# EAGLE design spu-schematic (EAGLE 9.6.2)
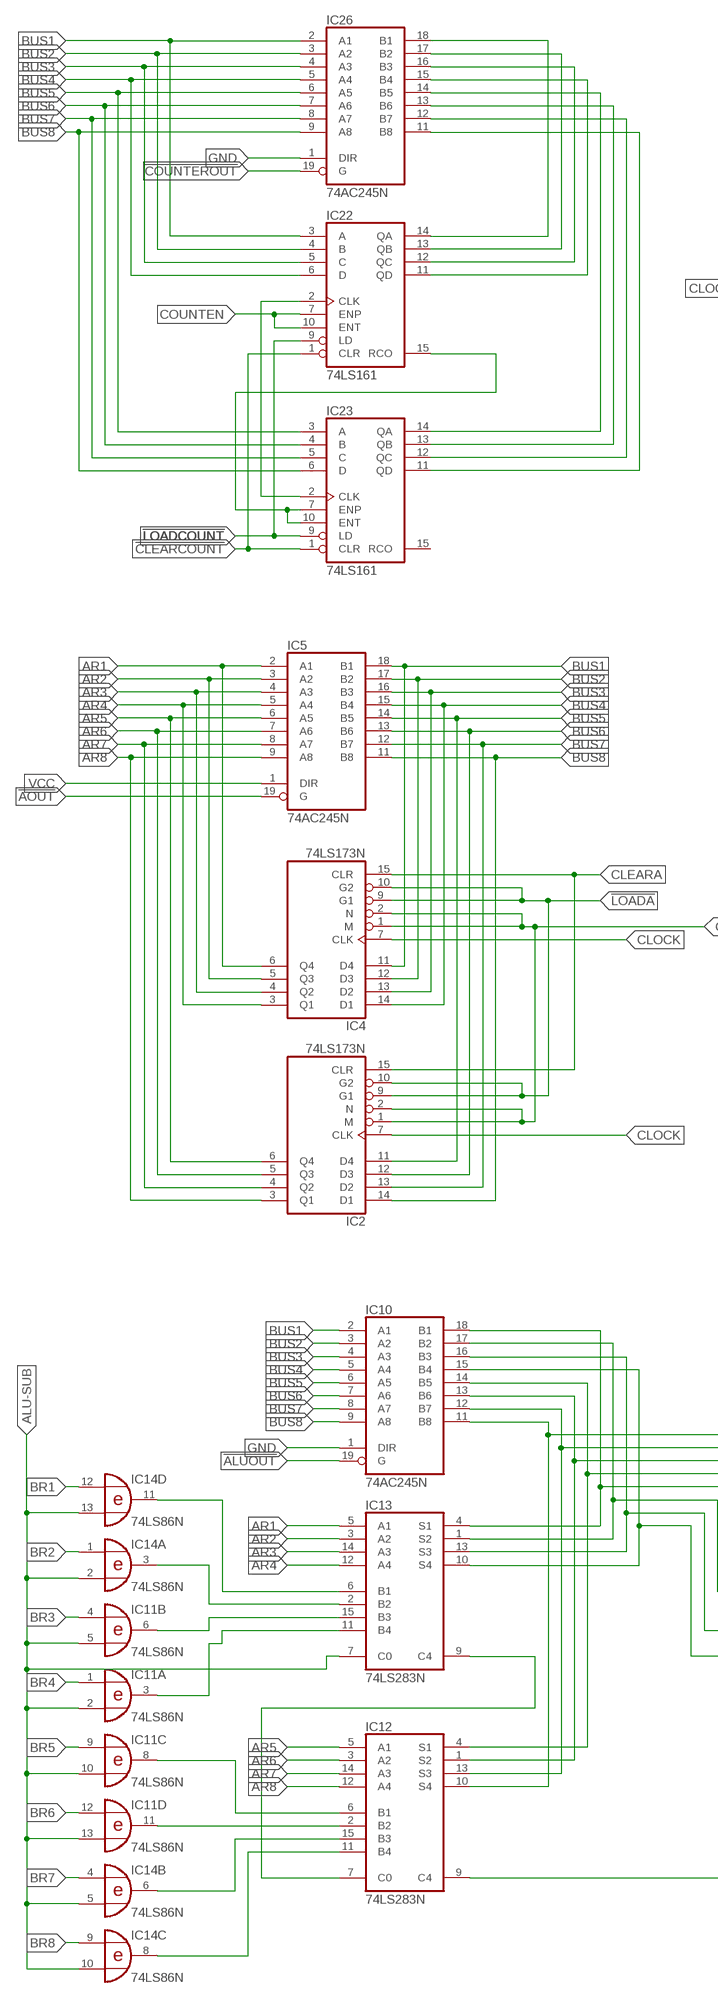
[diagram p0: schematic, sheet 1, part 1 of 2]
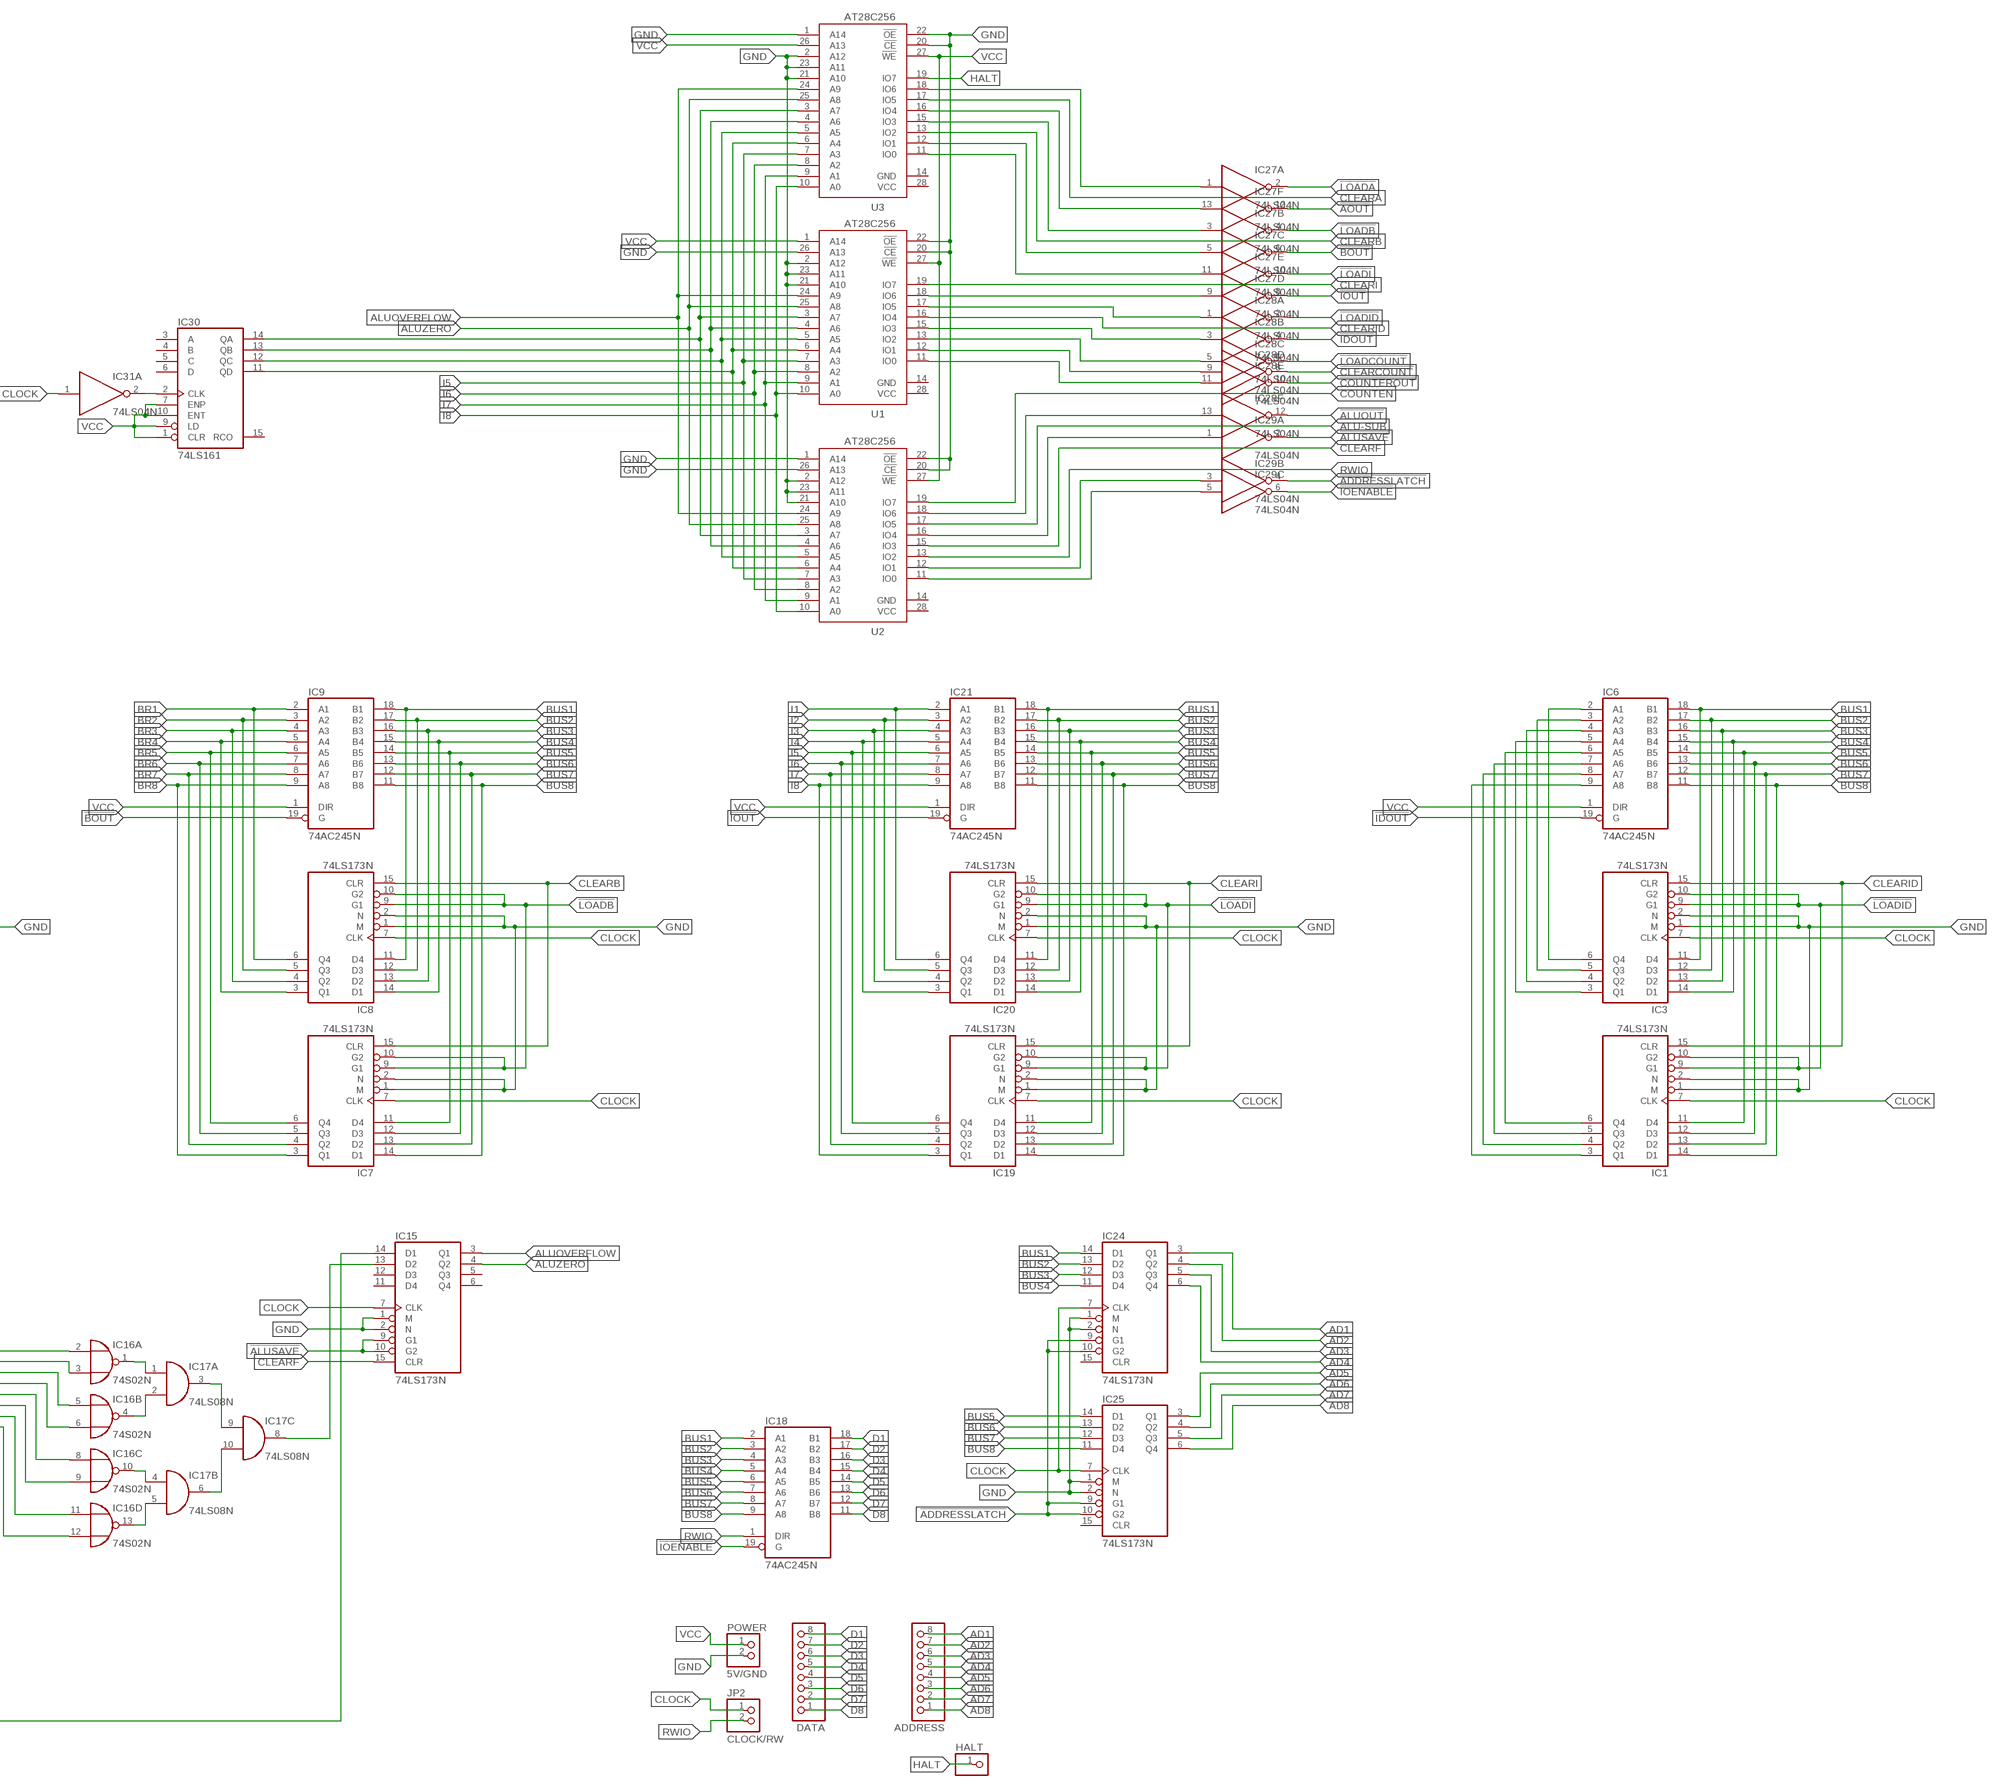
[diagram p1: schematic, sheet 1, part 2 of 2]

## Parts
ADDRESS  PINHD-1X8  [1X08]
DATA  PINHD-1X8  [1X08]
HALT  PINHD-1X1  [1X01]
IC1  74LS173N  [DIL16]
IC2  74LS173N  [DIL16]
IC3  74LS173N  [DIL16]
IC4  74LS173N  [DIL16]
IC5  74AC245N  [DIL20]
IC6  74AC245N  [DIL20]
IC7  74LS173N  [DIL16]
IC8  74LS173N  [DIL16]
IC9  74AC245N  [DIL20]
IC10  74AC245N  [DIL20]
IC11  74LS86N  [DIL14]
IC12  74LS283N  [DIL16]
IC13  74LS283N  [DIL16]
IC14  74LS86N  [DIL14]
IC15  74LS173N  [DIL16]
IC16  74S02N  [DIL14]
IC17  74LS08N  [DIL14]
IC18  74AC245N  [DIL20]
IC19  74LS173N  [DIL16]
IC20  74LS173N  [DIL16]
IC21  74AC245N  [DIL20]
IC22  74LS161  74HCT160N  [DIL16]
IC23  74LS161  74HCT160N  [DIL16]
IC24  74LS173N  [DIL16]
IC25  74LS173N  [DIL16]
IC26  74AC245N  [DIL20]
IC27  74LS04N  [DIL14]
IC28  74LS04N  [DIL14]
IC29  74LS04N  [DIL14]
IC30  74LS161  74HC160N  [DIL16]
IC31  74LS04N  [DIL14]
JP2  CLOCK/RW  PINHD-1X2  [1X02]
POWER  5V/GND  PINHD-1X2  [1X02]
U1  AT28C256  [DIL28-6]
U2  AT28C256  [DIL28-6]
U3  AT28C256  [DIL28-6]

## Nets
!ADDRESSLATCH: IC24.9(G1) IC24.10(G2) IC25.9(G1) IC25.10(G2) IC29.4(B:O)
!ALUOUT: IC10.19(G) IC28.12(F:O)
!ALUSAVE: IC15.9(G1) IC15.10(G2) IC29.2(A:O)
!AOUT: IC5.19(G) IC27.12(F:O)
!BOUT: IC9.19(G) IC27.6(C:O)
!CLEARCOUNT: IC22.1(CLR) IC23.1(CLR) IC28.8(D:O)
!COUNTEROUT: IC26.19(G) IC28.10(E:O)
!IDOUT: IC6.19(G) IC28.4(B:O)
!IOENABLE: IC18.19(G) IC29.6(C:O)
!IOUT: IC21.19(G) IC27.8(D:O)
!LOADA: IC2.9(G1) IC2.10(G2) IC4.9(G1) IC4.10(G2) IC27.2(A:O)
!LOADB: IC7.9(G1) IC7.10(G2) IC8.9(G1) IC8.10(G2) IC27.4(B:O)
!LOADCOUNT: IC22.9(LD) IC23.9(LD) IC28.6(C:O)
!LOADI: IC19.9(G1) IC19.10(G2) IC20.9(G1) IC20.10(G2) IC27.10(E:O)
!LOADID: IC1.9(G1) IC1.10(G2) IC3.9(G1) IC3.10(G2) IC28.2(A:O)
AD1: ADDRESS.8 IC24.3(Q1)
AD2: ADDRESS.7 IC24.4(Q2)
AD3: ADDRESS.6 IC24.5(Q3)
AD4: ADDRESS.5 IC24.6(Q4)
AD5: ADDRESS.4 IC25.3(Q1)
AD6: ADDRESS.3 IC25.4(Q2)
AD7: ADDRESS.2 IC25.5(Q3)
AD8: ADDRESS.1 IC25.6(Q4)
ALU-SUB: IC11.2(A:I1) IC11.5(B:I1) IC11.10(C:I1) IC11.13(D:I1) IC13.7(C0) IC14.2(A:I1) IC14.5(B:I1) IC14.10(C:I1) IC14.13(D:I1) U2.17(IO5)
ALUOVERFLOW: IC15.3(Q1) U1.24(A9) U2.24(A9) U3.24(A9)
ALUZERO: IC15.4(Q2) U1.25(A8) U2.25(A8) U3.25(A8)
AR1: IC4.6(Q4) IC5.2(A1) IC13.5(A1)
AR2: IC4.5(Q3) IC5.3(A2) IC13.3(A2)
AR3: IC4.4(Q2) IC5.4(A3) IC13.14(A3)
AR4: IC4.3(Q1) IC5.5(A4) IC13.12(A4)
AR5: IC2.6(Q4) IC5.6(A5) IC12.5(A1)
AR6: IC2.5(Q3) IC5.7(A6) IC12.3(A2)
AR7: IC2.4(Q2) IC5.8(A7) IC12.14(A3)
AR8: IC2.3(Q1) IC5.9(A8) IC12.12(A4)
BR1: IC8.6(Q4) IC9.2(A1) IC14.12(D:I0)
BR2: IC8.5(Q3) IC9.3(A2) IC14.1(A:I0)
BR3: IC8.4(Q2) IC9.4(A3) IC11.4(B:I0)
BR4: IC8.3(Q1) IC9.5(A4) IC11.1(A:I0)
BR5: IC7.6(Q4) IC9.6(A5) IC11.9(C:I0)
BR6: IC7.5(Q3) IC9.7(A6) IC11.12(D:I0)
BR7: IC7.4(Q2) IC9.8(A7) IC14.4(B:I0)
BR8: IC7.3(Q1) IC9.9(A8) IC14.9(C:I0)
BR9: IC3.6(Q4) IC6.2(A1)
BR10: IC3.5(Q3) IC6.3(A2)
BR11: IC3.4(Q2) IC6.4(A3)
BR12: IC3.3(Q1) IC6.5(A4)
BR13: IC1.5(Q3) IC6.7(A6)
BR14: IC1.6(Q4) IC6.6(A5)
BR15: IC1.4(Q2) IC6.8(A7)
BR16: IC1.3(Q1) IC6.9(A8)
BUS1: IC3.11(D4) IC4.11(D4) IC5.18(B1) IC6.18(B1) IC8.11(D4) IC9.18(B1) IC10.2(A1) IC18.2(A1) IC20.11(D4) IC21.18(B1) IC22.3(A) IC24.14(D1) IC26.2(A1)
BUS2: IC3.12(D3) IC4.12(D3) IC5.17(B2) IC6.17(B2) IC8.12(D3) IC9.17(B2) IC10.3(A2) IC18.3(A2) IC20.12(D3) IC21.17(B2) IC22.4(B) IC24.13(D2) IC26.3(A2)
BUS3: IC3.13(D2) IC4.13(D2) IC5.16(B3) IC6.16(B3) IC8.13(D2) IC9.16(B3) IC10.4(A3) IC18.4(A3) IC20.13(D2) IC21.16(B3) IC22.5(C) IC24.12(D3) IC26.4(A3)
BUS4: IC3.14(D1) IC4.14(D1) IC5.15(B4) IC6.15(B4) IC8.14(D1) IC9.15(B4) IC10.5(A4) IC18.5(A4) IC20.14(D1) IC21.15(B4) IC22.6(D) IC24.11(D4) IC26.5(A4)
BUS5: IC1.11(D4) IC2.11(D4) IC5.14(B5) IC6.14(B5) IC7.11(D4) IC9.14(B5) IC10.6(A5) IC18.6(A5) IC19.11(D4) IC21.14(B5) IC23.3(A) IC25.14(D1) IC26.6(A5)
BUS6: IC1.12(D3) IC2.12(D3) IC5.13(B6) IC6.13(B6) IC7.12(D3) IC9.13(B6) IC10.7(A6) IC18.7(A6) IC19.12(D3) IC21.13(B6) IC23.4(B) IC25.13(D2) IC26.7(A6)
BUS7: IC1.13(D2) IC2.13(D2) IC5.12(B7) IC6.12(B7) IC7.13(D2) IC9.12(B7) IC10.8(A7) IC18.8(A7) IC19.13(D2) IC21.12(B7) IC23.5(C) IC25.12(D3) IC26.8(A7)
BUS8: IC1.14(D1) IC2.14(D1) IC5.11(B8) IC6.11(B8) IC7.14(D1) IC9.11(B8) IC10.9(A8) IC18.9(A8) IC19.14(D1) IC21.11(B8) IC23.6(D) IC25.11(D4) IC26.9(A8)
CLEARA: IC2.15(CLR) IC4.15(CLR) U3.17(IO5)
CLEARB: IC7.15(CLR) IC8.15(CLR) U3.13(IO2)
CLEARF: IC15.15(CLR) U2.15(IO3)
CLEARI: IC19.15(CLR) IC20.15(CLR) U1.19(IO7)
CLEARID: IC1.15(CLR) IC3.15(CLR) U1.16(IO4)
CLOCK: IC1.7(CLK) IC2.7(CLK) IC3.7(CLK) IC4.7(CLK) IC7.7(CLK) IC8.7(CLK) IC15.7(CLK) IC19.7(CLK) IC20.7(CLK) IC24.7(CLK) IC25.7(CLK) IC30.2(CLK) IC31.1(A:I) IC31.2(A:O) JP2.1
COUNTEN: IC22.7(ENP) IC22.10(ENT) U2.19(IO7)
D1: DATA.8 IC18.18(B1)
D2: DATA.7 IC18.17(B2)
D3: DATA.6 IC18.16(B3)
D4: DATA.5 IC18.15(B4)
D5: DATA.4 IC18.14(B5)
D6: DATA.3 IC18.13(B6)
D7: DATA.2 IC18.12(B7)
D8: DATA.1 IC18.11(B8)
GND [power]: IC1.1(M) IC1.2(N) IC2.1(M) IC2.2(N) IC3.1(M) IC3.2(N) IC4.1(M) IC4.2(N) IC7.1(M) IC7.2(N) IC8.1(M) IC8.2(N) IC10.1(DIR) IC15.1(M) IC15.2(N) IC19.1(M) IC19.2(N) IC20.1(M) IC20.2(N) IC24.1(M) IC24.2(N) IC25.1(M) IC25.2(N) IC26.1(DIR) POWER.2 U1.2(A12) U1.20(!CE) U1.21(A10) U1.22(!OE) U1.23(A11) U1.26(A13) U2.1(A14) U2.2(A12) U2.20(!CE) U2.21(A10) U2.22(!OE) U2.23(A11) U2.26(A13) U3.1(A14) U3.2(A12) U3.20(!CE) U3.21(A10) U3.22(!OE) U3.23(A11)
HALT: HALT.1 U3.19(IO7)
I1: IC20.6(Q4) IC21.2(A1)
I2: IC20.5(Q3) IC21.3(A2)
I3: IC20.4(Q2) IC21.4(A3)
I4: IC20.3(Q1) IC21.5(A4)
I5: IC19.6(Q4) IC21.6(A5) U1.7(A3) U2.7(A3) U3.7(A3)
I6: IC19.5(Q3) IC21.7(A6) U1.8(A2) U2.8(A2) U3.8(A2)
I7: IC19.4(Q2) IC21.8(A7) U1.9(A1) U2.9(A1) U3.9(A1)
I8: IC19.3(Q1) IC21.9(A8) U1.10(A0) U2.10(A0) U3.10(A0)
N$1: IC12.7(C0) IC13.9(C4)
N$2: IC12.11(B4) IC14.8(C:O)
N$3: IC12.9(C4) IC15.14(D1)
N$4: IC10.14(B5) IC12.4(S1) IC16.6(B:I1)
N$5: IC10.13(B6) IC12.1(S2) IC16.5(B:I0)
N$6: IC13.6(B1) IC14.11(D:O)
N$7: IC13.2(B2) IC14.3(A:O)
N$8: IC11.6(B:O) IC13.15(B3)
N$9: IC11.3(A:O) IC13.11(B4)
N$10: IC10.18(B1) IC13.4(S1) IC16.8(C:I0)
N$11: IC10.17(B2) IC13.1(S2) IC16.9(C:I1)
N$12: IC10.16(B3) IC13.13(S3) IC16.11(D:I0)
N$13: IC10.15(B4) IC13.10(S4) IC16.12(D:I1)
N$14: IC10.12(B7) IC12.13(S3) IC16.3(A:I1)
N$15: IC10.11(B8) IC12.10(S4) IC16.2(A:I0)
N$16: IC16.1(A:O) IC17.1(A:I0)
N$17: IC22.15(RCO) IC23.7(ENP) IC23.10(ENT)
N$18: IC29.3(B:I) U2.12(IO1)
N$19: IC22.2(CLK) IC23.2(CLK)
N$20: IC29.5(C:I) U2.11(IO0)
N$21: IC11.8(C:O) IC12.6(B1)
N$22: IC11.11(D:O) IC12.2(B2)
N$23: IC12.15(B3) IC14.6(B:O)
N$24: IC22.14(QA) IC26.18(B1)
N$25: IC22.13(QB) IC26.17(B2)
N$26: IC16.4(B:O) IC17.2(A:I1)
N$27: IC16.10(C:O) IC17.4(B:I0)
N$28: IC16.13(D:O) IC17.5(B:I1)
N$29: IC17.3(A:O) IC17.9(C:I0)
N$30: IC17.6(B:O) IC17.10(C:I1)
N$31: IC15.13(D2) IC17.8(C:O)
N$32: IC22.12(QC) IC26.16(B3)
N$33: IC22.11(QD) IC26.15(B4)
N$34: IC23.14(QA) IC26.14(B5)
N$35: IC23.13(QB) IC26.13(B6)
N$36: IC23.12(QC) IC26.12(B7)
N$37: IC23.11(QD) IC26.11(B8)
N$38: IC29.1(A:I) U2.16(IO4)
N$39: IC28.13(F:I) U2.18(IO6)
N$40: IC28.11(E:I) U1.11(IO0)
N$41: IC28.9(D:I) U1.12(IO1)
N$42: IC28.5(C:I) U1.13(IO2)
N$43: IC28.3(B:I) U1.15(IO3)
N$44: IC28.1(A:I) U1.17(IO5)
N$45: IC27.9(D:I) U1.18(IO6)
N$46: IC27.11(E:I) U3.11(IO0)
N$47: IC27.5(C:I) U3.12(IO1)
N$48: IC27.3(B:I) U3.15(IO3)
N$49: IC27.13(F:I) U3.16(IO4)
N$50: IC27.1(A:I) U3.18(IO6)
N$51: IC30.14(QA) U1.3(A7) U2.3(A7) U3.3(A7)
N$55: IC30.13(QB) U1.4(A6) U2.4(A6) U3.4(A6)
N$56: IC30.12(QC) U1.5(A5) U2.5(A5) U3.5(A5)
N$57: IC30.11(QD) U1.6(A4) U2.6(A4) U3.6(A4)
RWIO: IC18.1(DIR) JP2.2 U2.13(IO2)
VCC [power]: IC5.1(DIR) IC6.1(DIR) IC9.1(DIR) IC21.1(DIR) IC30.1(CLR) IC30.7(ENP) IC30.9(LD) IC30.10(ENT) POWER.1 U1.1(A14) U1.27(!WE) U2.27(!WE) U3.26(A13) U3.27(!WE)
Unconnected: IC15.5(Q3) IC15.6(Q4) IC15.11(D4) IC15.12(D3) IC17.11(D:O) IC17.12(D:I0) IC17.13(D:I1) IC23.15(RCO) IC24.15(CLR) IC25.15(CLR) IC29.8(D:O) IC29.9(D:I) IC29.10(E:O) IC29.11(E:I) IC29.12(F:O) IC29.13(F:I) IC30.3(A) IC30.4(B) IC30.5(C) IC30.6(D) IC30.15(RCO) IC31.3(B:I) IC31.4(B:O) IC31.5(C:I) IC31.6(C:O) IC31.8(D:O) IC31.9(D:I) IC31.10(E:O) IC31.11(E:I) IC31.12(F:O) IC31.13(F:I) U1.14(GND) U1.28(VCC) U2.14(GND) U2.28(VCC) U3.14(GND) U3.28(VCC)

## Power pins joined to a net without a drawn wire
GND: IC1.8(GND) IC2.8(GND) IC3.8(GND) IC4.8(GND) IC5.10(GND) IC6.10(GND) IC7.8(GND) IC8.8(GND) IC9.10(GND) IC10.10(GND) IC11.7(P:GND) IC12.8(GND) IC13.8(GND) IC14.7(P:GND) IC15.8(GND) IC16.7(P:GND) IC17.7(P:GND) IC18.10(GND) IC19.8(GND) IC20.8(GND) IC21.10(GND) IC22.8(GND) IC23.8(GND) IC24.8(GND) IC25.8(GND) IC26.10(GND) IC27.7(P:GND) IC28.7(P:GND) IC29.7(P:GND) IC30.8(GND) IC31.7(P:GND)
VCC: IC1.16(VCC) IC2.16(VCC) IC3.16(VCC) IC4.16(VCC) IC5.20(VCC) IC6.20(VCC) IC7.16(VCC) IC8.16(VCC) IC9.20(VCC) IC10.20(VCC) IC11.14(P:VCC) IC12.16(VCC) IC13.16(VCC) IC14.14(P:VCC) IC15.16(VCC) IC16.14(P:VCC) IC17.14(P:VCC) IC18.20(VCC) IC19.16(VCC) IC20.16(VCC) IC21.20(VCC) IC22.16(VCC) IC23.16(VCC) IC24.16(VCC) IC25.16(VCC) IC26.20(VCC) IC27.14(P:VCC) IC28.14(P:VCC) IC29.14(P:VCC) IC30.16(VCC) IC31.14(P:VCC)

## Library data of the parts
ADDRESS DATA = pinhead:PINHD-1X8: PIN HEADER
HALT = pinhead:PINHD-1X1: PIN HEADER
IC1-IC4 IC7 IC8 IC15 IC19 IC20 IC24 IC25 = 74xx-us:74*173: 4-bit D type REGISTER, 3-state
IC5 IC6 IC9 IC10 IC18 IC21 IC26 = 74xx-eu:74*245: Octal BUS TRANSCEIVER, 3-state
IC11 IC14 = 74xx-eu:74*86: Quad 2-input EXCLUSIVE-OR (XOR) gate
IC12 IC13 = 74xx-eu:74*283: 4-bit binary FULL ADDER, fast carry
IC16 = 74xx-eu:74*02: Quad 2-input NOR gate
IC17 = 74xx-eu:74*08: Quad 2-input AND gate
IC22 IC23 IC30 = 74xx-eu:74*160: Synchronous 4-bit COUNTER
IC27-IC29 IC31 = 74xx-eu:74*04: Hex INVERTER
JP2 POWER = pinhead:PINHD-1X2: PIN HEADER
U1-U3 = bt_memory:AT28C256: EEPROM 32Kx8 256k bit The AT28C256 is a high-performance Electrically Erasable and Programmable Read Only Memory. Its 256K of memory is organized as 32,768 words by 8 bits.

## Net classes
0 default: width 0.762 mm, clearance 0.2 mm
1 power: width 0.762 mm, clearance 0.2 mm

## Board
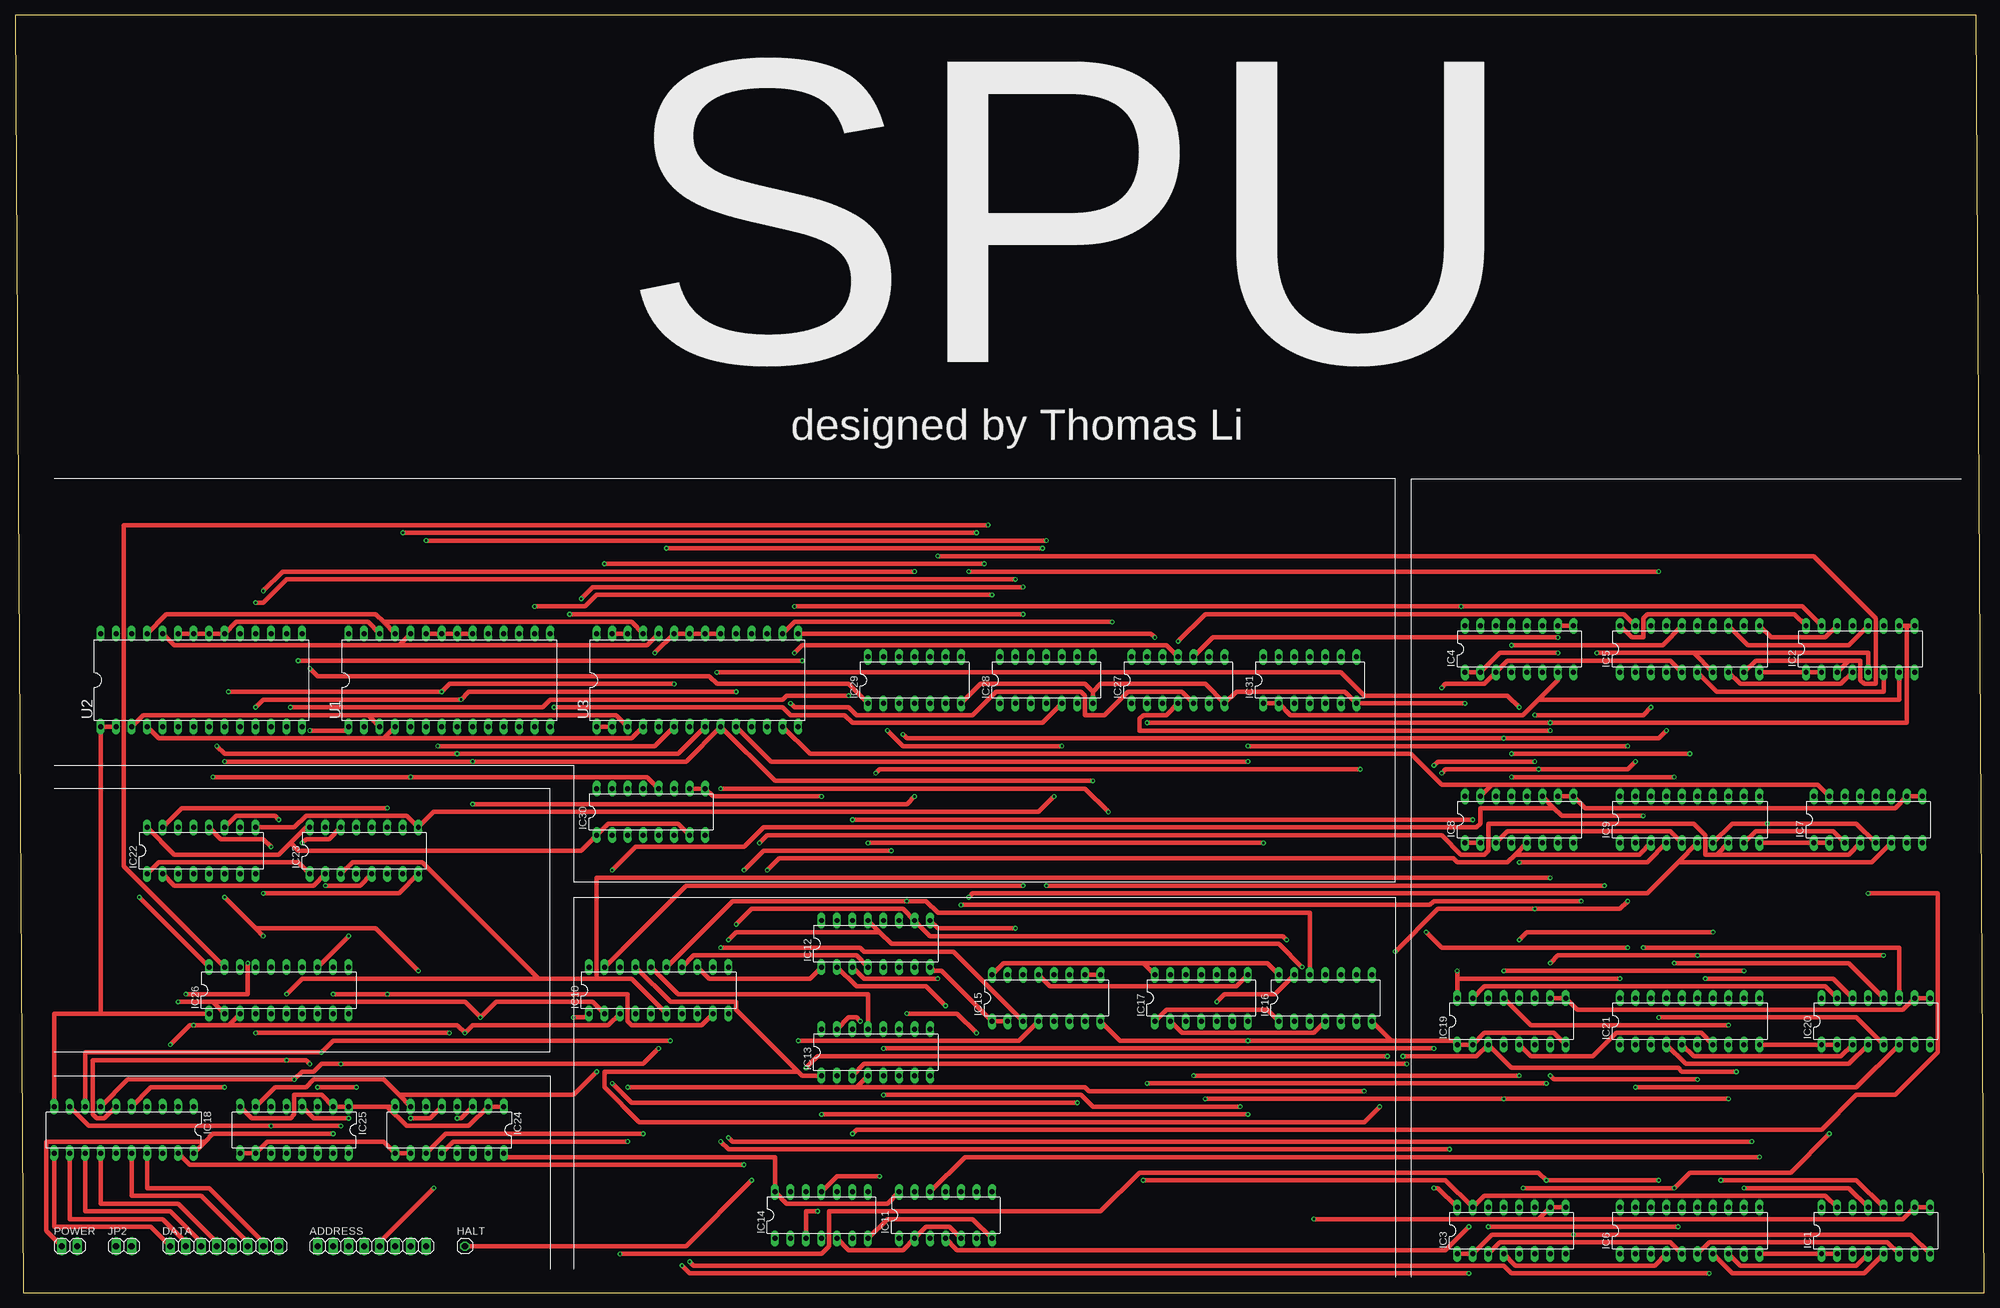
[diagram p2: board, top side]
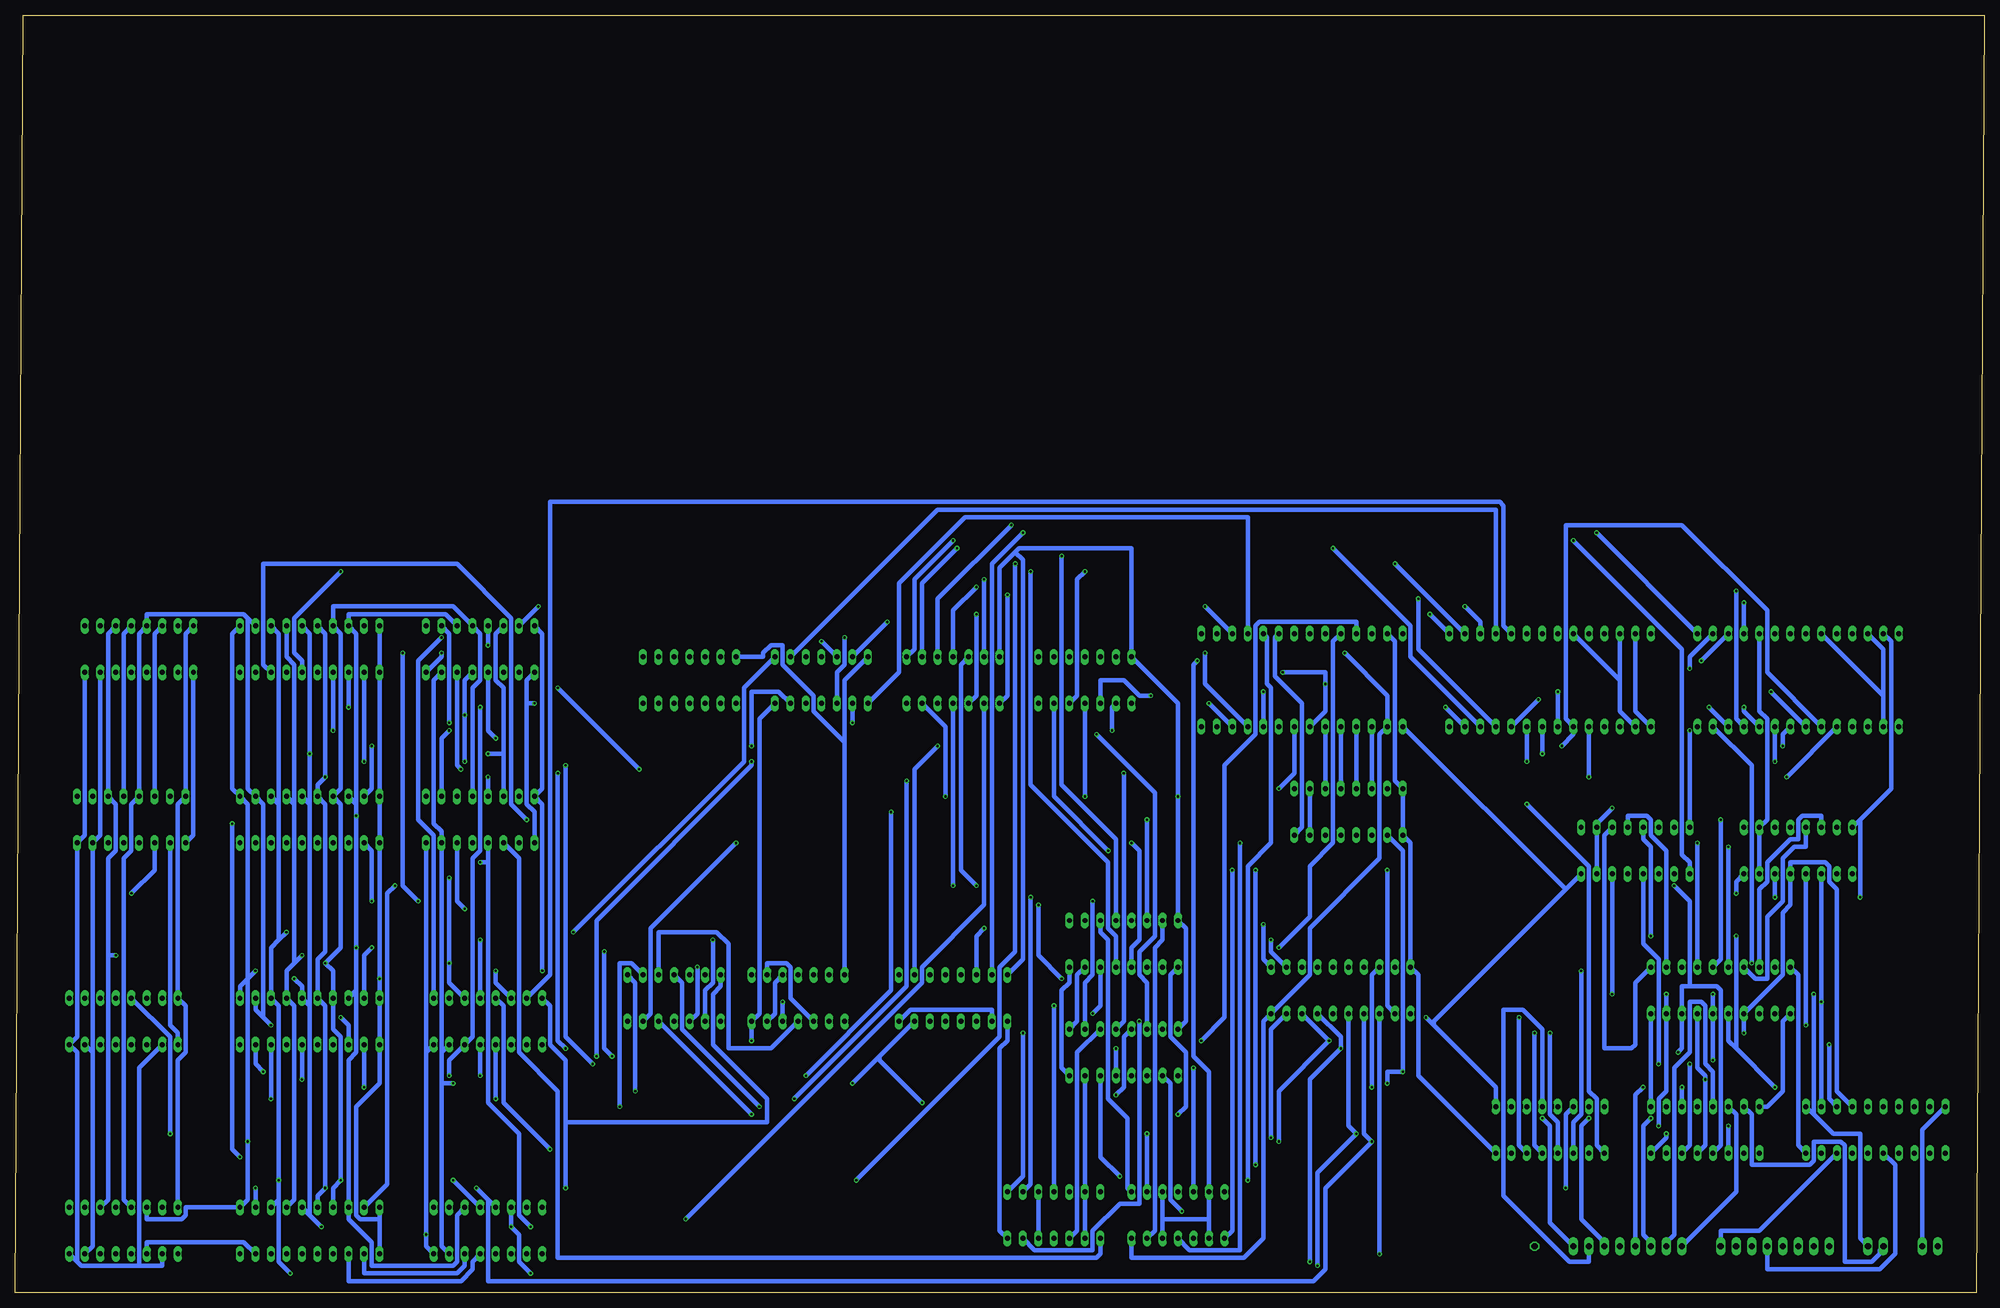
[diagram p3: board, bottom side, seen from below]

Size 322.56 x 209.22 mm. Coordinates in mm from the lower left corner, seen from the top.
Outline: 1.27,0 322.56,0 321.29,209.22 0,209.22 1.27,0
Copper layers (1*16): Top 0.035mm / dielectric 1.5mm / Bottom 0.035mm
Design rules "default *": minimum track width 6mil, minimum drill 0.35mm, track to track 6mil, track to pad 6mil, pad to pad 6mil, via to via 6mil, smd to smd 6mil, copper to edge 40mil, drill to drill 6mil, minimum pad ring 10mil, minimum via ring 8mil, stop-mask expansion 4mil, vias tented up to drill 0mil, thermal gap 10mil

### Footprints (pad centres in the part's own frame; a part is rotated, then mirrored left to right if it is on the bottom)
1X08 = drill 1.016 long: 1 -8.89,0; 2 -6.35,0; 3 -3.81,0; 4 -1.27,0; 5 1.27,0; 6 3.81,0; 7 6.35,0; 8 8.89,0
1X01 = drill 1.016 octagon: 1 0,0
DIL16 = drill 0.813 long: 1 -8.89,-3.81; 2 -6.35,-3.81; 3 -3.81,-3.81; 4 -1.27,-3.81; 5 1.27,-3.81; 6 3.81,-3.81; 7 6.35,-3.81; 8 8.89,-3.81; 9 8.89,3.81; 10 6.35,3.81; 11 3.81,3.81; 12 1.27,3.81; 13 -1.27,3.81; 14 -3.81,3.81; 15 -6.35,3.81; 16 -8.89,3.81
DIL20 = drill 0.813 long: 1 -11.43,-3.81; 2 -8.89,-3.81; 3 -6.35,-3.81; 4 -3.81,-3.81; 5 -1.27,-3.81; 6 1.27,-3.81; 7 3.81,-3.81; 8 6.35,-3.81; 9 8.89,-3.81; 10 11.43,-3.81; 11 11.43,3.81; 12 8.89,3.81; 13 6.35,3.81; 14 3.81,3.81; 15 1.27,3.81; 16 -1.27,3.81; 17 -3.81,3.81; 18 -6.35,3.81; 19 -8.89,3.81; 20 -11.43,3.81
DIL14 = drill 0.813 long: 1 -7.62,-3.81; 2 -5.08,-3.81; 3 -2.54,-3.81; 4 0,-3.81; 5 2.54,-3.81; 6 5.08,-3.81; 7 7.62,-3.81; 8 7.62,3.81; 9 5.08,3.81; 10 2.54,3.81; 11 0,3.81; 12 -2.54,3.81; 13 -5.08,3.81; 14 -7.62,3.81
1X02 = drill 1.016 long: 1 -1.27,0; 2 1.27,0
DIL28-6 = drill 0.813 long: 1 -16.51,-7.62; 2 -13.97,-7.62; 3 -11.43,-7.62; 4 -8.89,-7.62; 5 -6.35,-7.62; 6 -3.81,-7.62; 7 -1.27,-7.62; 8 1.27,-7.62; 9 3.81,-7.62; 10 6.35,-7.62; 11 8.89,-7.62; 12 11.43,-7.62; 13 13.97,-7.62; 14 16.51,-7.62; 15 16.51,7.62; 16 13.97,7.62; 17 11.43,7.62; 18 8.89,7.62; 19 6.35,7.62; 20 3.81,7.62; 21 1.27,7.62; 22 -1.27,7.62; 23 -3.81,7.62; 24 -6.35,7.62; 25 -8.89,7.62; 26 -11.43,7.62; 27 -13.97,7.62; 28 -16.51,7.62

### Placement (x,y rotation side)
ADDRESS  58.42,7.62 0 top
DATA  34.29,7.62 0 top
HALT  73.66,7.62 0 top
IC1  304.8,10.16 0 top
IC2  302.26,105.41 0 top
IC3  245.11,10.16 0 top
IC4  246.38,105.41 0 top
IC5  274.32,105.41 0 top
IC6  274.32,10.16 0 top
IC7  303.53,77.47 0 top
IC8  246.38,77.47 0 top
IC9  274.32,77.47 0 top
IC10  105.41,49.53 0 top
IC11  152.4,12.7 0 top
IC12  140.97,57.15 0 top
IC13  140.97,39.37 0 top
IC14  132.08,12.7 0 top
IC15  168.91,48.26 0 top
IC16  214.63,48.26 0 top
IC17  194.31,48.26 0 top
IC18  17.78,26.67 180 top
IC19  245.11,44.45 0 top
IC20  304.8,44.45 0 top
IC21  274.32,44.45 0 top
IC22  30.48,72.39 0 top
IC23  57.15,72.39 0 top
IC24  71.12,26.67 180 top
IC25  45.72,26.67 180 top
IC26  43.18,49.53 0 top
IC27  190.5,100.33 0 top
IC28  168.91,100.33 0 top
IC29  147.32,100.33 0 top
IC30  104.14,78.74 0 top
IC31  212.09,100.33 0 top
JP2  17.78,7.62 0 top
POWER  8.89,7.62 0 top
U1  71.12,100.33 0 top
U2  30.48,100.33 0 top
U3  111.76,100.33 0 top

### Tracks (layer width: path | path; a pad name or v marks a point on that pad's centre or on a via)
!ADDRESSLATCH  (via drill 0.35)
  Top 0.762: IC25.9 IC25.10 41.28,24.77 60.33,24.77 IC24.9 IC24.10 | v147.32,81.28 146.05,80.01 v74.93,80.01
  Bottom 0.762: v147.32,81.28 IC29.4 | v74.93,80.01 64.77,69.85 64.77,33.02 63.5,31.75 63.5,24.13 IC24.9
!ALUOUT  (via drill 0.35)
  Top 0.762: IC10.19 109.85,66.67 v165.1,66.67
  Bottom 0.762: v165.1,66.67 167.64,69.22 167.64,102.87 IC28.12
!ALUSAVE  (via drill 0.35)
  Top 0.762: IC15.9 IC15.10 | v142.88,92.08 145.42,89.53 v171.45,89.53
  Bottom 0.762: IC29.2 142.88,95.89 v142.88,92.08 | v171.45,89.53 175.26,85.72 IC15.10
!AOUT  (via drill 0.35)
  Top 0.762: v190.5,106.68 194.95,111.12 263.52,111.12 IC5.19
  Bottom 0.762: v190.5,106.68 IC27.12
!BOUT  (via drill 0.35)
  Top 0.762: v264.16,89.53 v201.93,89.53
  Bottom 0.762: IC27.6 197.49,98.42 201.93,98.42 v201.93,89.53 | v264.16,89.53 264.16,82.55 IC9.19
!CLEARCOUNT  (via drill 0.35)
  Top 0.762: IC22.1 23.5,70.48 46.36,70.48 IC23.1 | v67.31,123.19 v168.91,123.19
  Bottom 0.762: IC28.8 175.26,105.41 175.26,116.84 v168.91,123.19 | v67.31,123.19 49.53,105.41 49.53,71.75 48.26,70.48 IC23.1
!COUNTEROUT  (via drill 0.35)
  Top 0.762: IC26.19 17.78,69.85 17.78,125.73 v159.39,125.73
  Bottom 0.762: v159.39,125.73 171.45,113.67 IC28.10
!IDOUT  (via drill 0.35)
  Top 0.762: v260.35,66.67 v168.91,66.67
  Bottom 0.762: v168.91,66.67 IC28.4 | v260.35,66.67 261.62,65.41 261.62,17.78 IC6.19
!IOENABLE  (via drill 0.35)
  Top 0.762: IC18.19 28.57,20.95 v119.38,20.95 | v119.38,69.22 122.55,72.39 v143.51,72.39
  Bottom 0.762: v119.38,69.22 v119.38,20.95 | v143.51,72.39 152.4,81.28 IC29.6
!IOUT  (via drill 0.35)
  Top 0.762: v231.14,59.05 233.68,56.52 v264.16,56.52
  Bottom 0.762: IC27.8 203.2,99.06 203.2,87 v231.14,59.05 | v264.16,56.52 265.43,55.24 IC21.19
!LOADA  (via drill 0.35)
  Top 0.762: IC2.9 309.88,109.22 | 309.88,109.22 IC2.10 | v185.42,93.34 v251.46,93.34 309.88,93.34 309.88,109.22 | IC4.10 IC4.9
  Bottom 0.762: v185.42,93.34 IC27.2 | v251.46,93.34 251.46,107.95 IC4.10
!LOADB  (via drill 0.35)
  Top 0.762: IC7.9 IC7.10 307.97,79.38 257.18,79.38 IC8.9 IC8.10 | IC27.4 188.59,94.61 184.78,94.61 184.15,93.98 184.15,92.08 v251.46,92.08
  Bottom 0.762: v251.46,92.08 252.73,90.81 IC8.10
!LOADCOUNT  (via drill 0.35)
  Top 0.762: IC22.9 45.72,76.2 47.62,78.11 64.14,78.11 IC23.9 68.58,78.74 167.64,78.74 v170.18,81.28
  Bottom 0.762: IC28.6 170.18,92.71 v170.18,81.28
!LOADI  (via drill 0.35)
  Top 0.762: IC20.9 IC20.10 309.25,46.35 255.91,46.35 IC19.9 IC19.10 | IC27.10 196.22,107.31 v252.73,107.31
  Bottom 0.762: v252.73,107.31 256.54,103.5 256.54,77.47 254,74.93 IC19.9
!LOADID  (via drill 0.35)
  Top 0.762: IC1.9 IC1.10 309.25,12.06 249.56,12.06 | IC3.9 IC3.10 249.56,12.06 | 249.56,12.06 v212.73,12.06
  Bottom 0.762: IC28.2 163.83,63.5 173.99,53.34 173.99,50.8 v212.73,12.06
AD1  (via drill 0.35)
  Top 0.762: IC24.3 73.02,28.57 v72.39,28.57
  Bottom 0.762: v72.39,28.57 71.12,27.3 71.12,11.43 ADDRESS.8
AD2
  Bottom 0.762: IC24.4 72.39,43.18 75.56,46.35 78.74,46.35 78.74,15.88 67.94,5.08 64.77,5.08 ADDRESS.7
AD3  (via drill 0.35)
  Top 0.762: IC24.5 67.94,28.57 v64.77,28.57
  Bottom 0.762: v64.77,28.57 66.04,27.3 66.04,12.06 62.23,8.26 ADDRESS.6
AD4  (via drill 0.35)
  Top 0.762: v68.58,17.14 59.69,8.26 ADDRESS.5
  Bottom 0.762: IC24.6 68.58,29.21 v68.58,17.14
AD5  (via drill 0.35)
  Top 0.762: v55.88,33.66 v49.53,33.66
  Bottom 0.762: v49.53,33.66 IC25.3 | v55.88,33.66 57.15,32.38 ADDRESS.4
AD6  (via drill 0.35)
  Top 0.762: IC25.4 48.9,28.57 v54.61,28.57
  Bottom 0.762: v54.61,28.57 55.88,27.3 55.88,9.53 54.61,8.26 ADDRESS.3
AD7
  Bottom 0.762: IC25.5 44.45,36.2 45.72,37.47 45.72,46.99 46.36,47.62 48.26,47.62 48.26,39.37 50.8,36.83 50.8,9.53 52.07,8.26 ADDRESS.2
AD8
  Bottom 0.762: IC25.6 40.64,29.21 40.64,16.51 ADDRESS.1
ALU-SUB  (via drill 0.35)
  Top 0.762: IC11.5 153.03,10.79 149.23,10.79 IC11.2 145.42,6.99 136.53,6.99 IC14.5 | v128.91,103.5 v46.36,103.5
  Bottom 0.762: IC11.10 IC11.5 | IC11.2 IC11.13 IC13.7 | IC14.10 134.62,12.06 | 134.62,12.06 IC14.5 | 127,12.06 IC14.13 127,36.2 129.54,38.73 129.54,102.87 v128.91,103.5 | 127,12.06 IC14.2 | v46.36,103.5 U2.17 | 127,12.06 134.62,12.06
ALUOVERFLOW  (via drill 0.35)
  Top 0.762: U2.24 26.04,106.05 62.87,106.05 | U1.24 62.87,106.05 | U3.24 103.5,106.05 62.87,106.05 | IC15.3 153.67,55.88 139.06,55.88 138.43,56.52 v115.57,56.52
  Bottom 0.762: v115.57,56.52 110.49,61.59 110.49,69.85 106.68,73.66 106.68,106.68 U3.24
ALUZERO  (via drill 0.35)
  Top 0.762: U2.25 24.77,111.12 59.05,111.12 60.33,109.86 | U1.25 60.33,109.86 | U3.25 100.96,109.86 60.33,109.86 | IC15.4 164.47,41.27 v128.27,41.27
  Bottom 0.762: v128.27,41.27 124.46,45.09 124.46,86.36 119.38,91.44 119.38,109.22 118.74,109.86 102.87,109.86 U3.25
AR1  (via drill 0.35)
  Top 0.762: v232.41,40.01 v142.24,40.01 | v233.68,85.09 234.31,85.72 v249.56,85.72 264.16,85.72 v265.43,87
  Bottom 0.762: v142.24,40.01 IC13.5 | v232.41,40.01 233.68,41.27 v233.68,85.09 | v249.56,85.72 250.19,86.36 IC4.6 | v265.43,87 IC5.2
AR2  (via drill 0.35)
  Top 0.762: IC13.3 139.06,37.47 v227.97,37.47 | v232.41,86.36 233.05,87 v248.92,87 | v267.97,95.89 266.7,94.61 v248.92,94.61
  Bottom 0.762: v227.97,37.47 232.41,41.91 v232.41,86.36 | v248.92,87 v248.92,94.61 248.92,100.33 IC4.5 | v267.97,95.89 IC5.3
AR3  (via drill 0.35)
  Top 0.762: v145.42,91.44 146.05,90.81 v243.84,90.81 269.24,90.81 v270.51,92.08
  Bottom 0.762: IC13.14 137.16,50.8 138.43,52.07 138.43,55.88 135.89,58.42 135.89,81.92 v145.42,91.44 | v243.84,90.81 245.11,92.08 IC4.4 | v270.51,92.08 IC5.4
AR4  (via drill 0.35)
  Top 0.762: v140.97,85.09 141.61,85.72 v220.34,85.72 | v233.68,99.06 234.31,99.69 240.67,99.69 IC4.3 244.48,103.5 271.14,103.5 IC5.5
  Bottom 0.762: IC13.12 140.97,44.45 v140.97,85.09 | v233.68,99.06 v220.34,85.72
AR5  (via drill 0.35)
  Top 0.762: v269.24,118.11 v156.21,118.11 | IC2.6 306.07,98.42 278.76,98.42 IC5.6
  Bottom 0.762: IC12.5 142.24,58.42 143.51,59.69 143.51,70.48 156.21,83.19 v156.21,118.11 | v269.24,118.11 276.86,110.49 276.86,104.78 275.59,103.5 IC5.6
AR6  (via drill 0.35)
  Top 0.762: IC12.3 139.06,51.44 v151.13,51.44 | v154.94,63.5 231.78,63.5 232.41,64.14 v256.54,64.14 | 274.95,104.78 v259.08,104.78 | IC5.7 274.95,104.78 | IC2.5 303.53,104.78 274.95,104.78
  Bottom 0.762: v151.13,51.44 154.94,55.24 v154.94,63.5 | v256.54,64.14 259.08,66.67 v259.08,104.78
AR7  (via drill 0.35)
  Top 0.762: v238.76,77.47 v137.16,77.47 | IC2.4 299.08,99.69 282.57,99.69 IC5.8
  Bottom 0.762: v137.16,77.47 IC12.14 | v238.76,77.47 241.3,80.01 241.3,110.49 250.19,119.38 281.94,119.38 281.94,102.87 IC5.8
AR8  (via drill 0.35)
  Top 0.762: v151.13,120.65 294.64,120.65 304.8,110.49 304.8,99.69 302.89,99.69 302.26,100.33 302.26,103.5 300.35,103.5 | IC2.3 300.35,103.5 | IC5.9 285.12,103.5 300.35,103.5
  Bottom 0.762: IC12.12 142.24,74.3 151.13,83.19 v151.13,120.65
BR1  (via drill 0.35)
  Top 0.762: v129.54,36.83 131.45,38.73 v224.79,38.73 | v226.06,55.88 233.05,62.87 v248.92,62.87 262.89,62.87 v264.16,64.14
  Bottom 0.762: v129.54,36.83 IC14.12 | v224.79,38.73 226.06,40.01 v226.06,55.88 | v248.92,62.87 250.19,64.14 IC8.6 | IC9.2 264.16,72.39 v264.16,64.14
BR2  (via drill 0.35)
  Top 0.762: v123.19,69.22 125.09,71.12 235.59,71.12 236.22,70.48 244.48,70.48 245.75,71.75 | IC8.5 245.75,71.75 | IC9.3 266.06,71.75 245.75,71.75
  Bottom 0.762: IC14.1 123.19,10.16 v123.19,69.22
BR3  (via drill 0.35)
  Top 0.762: IC11.4 154.31,6.99 234.31,6.99 v238.12,10.79 | IC9.4 267.33,70.48 v246.38,70.48
  Bottom 0.762: v238.12,10.79 240.03,12.7 240.03,26.04 245.11,31.11 245.11,70.48 | IC8.4 245.11,70.48 | 245.11,70.48 v246.38,70.48
BR4
  Top 0.762: IC9.5 271.14,75.56 244.48,75.56 IC8.3
  Bottom 0.762: IC11.1 144.78,6.35 145.42,5.71 233.68,5.71 233.68,33.02 240.03,39.37 240.03,71.12 IC8.3
BR5  (via drill 0.35)
  Top 0.762: v156.21,64.77 156.84,65.41 267.33,65.41 272.41,70.48 | IC9.6 272.41,70.48 | IC7.6 304.16,70.48 272.41,70.48
  Bottom 0.762: IC11.9 156.21,17.78 v156.21,64.77
BR6  (via drill 0.35)
  Top 0.762: IC11.12 155.58,22.23 v285.75,22.23 | IC9.7 281.31,76.83 v287.02,76.83 301.62,76.83 IC7.5
  Bottom 0.762: v285.75,22.23 287.02,23.5 v287.02,76.83
BR7  (via drill 0.35)
  Top 0.762: v121.92,73.66 123.19,74.93 233.68,74.93 236.86,71.75 240.67,71.75 241.3,72.39 241.3,76.83 274.95,76.83 276.86,74.93 276.86,71.75 278.76,71.75 | IC9.8 278.76,71.75 | IC7.4 300.35,71.75 278.76,71.75
  Bottom 0.762: IC14.4 130.18,6.99 121.92,6.99 v121.92,73.66
BR8  (via drill 0.35)
  Top 0.762: v137.16,26.04 137.8,26.67 295.91,26.67 301.62,32.38 307.97,32.38 314.96,39.37 314.96,65.41 v303.53,65.41 | IC9.9 285.12,75.56 297.81,75.56 IC7.3
  Bottom 0.762: v137.16,26.04 IC14.9 | v303.53,65.41 299.72,69.22 IC7.3
BR9
  Bottom 0.762: IC3.6 248.92,4.45 250.19,3.17 265.43,3.17 IC6.2
BR10
  Bottom 0.762: IC3.5 247.65,5.08 247.65,3.81 249.56,1.91 267.97,1.91 IC6.3
BR11
  Top 0.762: IC3.4 245.75,4.45 268.6,4.45 IC6.4
BR12
  Top 0.762: IC3.3 243.21,8.26 271.14,8.26 IC6.5
BR13
  Top 0.762: IC6.7 281.31,3.17 302.89,3.17 IC1.5
BR14
  Top 0.762: IC6.6 277.5,8.26 306.7,8.26 IC1.6
BR15
  Top 0.762: IC6.8 282.57,4.45 301.62,4.45 IC1.4
BR16
  Bottom 0.762: IC6.9 285.12,8.26 300.99,8.26 IC1.3
BUS1  (via drill 0.35)
  Top 0.762: IC10.2 94.61,47.62 78.74,47.62 v76.2,45.09 73.66,47.62 32.38,47.62 | 32.38,47.62 IC26.2 | v26.67,47.62 32.38,47.62 | 252.09,79.38 253.37,78.11 v266.7,78.11 | 252.09,79.38 IC8.11 | IC20.11 308.61,56.52 v266.7,56.52 | v97.79,69.22 101.6,73.03 119.38,73.03 122.55,76.2 239.4,76.2 240.03,76.83 240.03,79.38 252.09,79.38
  Bottom 0.762: IC24.14 76.2,24.13 v76.2,45.09 | IC22.3 v26.67,47.62 IC18.2 | IC3.11 250.19,12.7 250.19,5.08 250.83,4.45 264.16,4.45 264.16,8.26 267.97,12.06 IC6.18 267.97,38.1 266.7,39.37 266.7,49.53 | IC4.11 252.09,111.12 267.97,111.12 IC5.18 266.7,107.95 266.7,80.01 | 266.7,49.53 IC21.18 | 266.7,80.01 v266.7,78.11 v266.7,56.52 266.7,49.53 | IC9.18 266.7,80.01 | IC10.2 97.79,46.99 v97.79,69.22
BUS2  (via drill 0.35)
  Top 0.762: IC10.3 97.16,43.81 74.93,43.81 v73.66,42.55 72.39,43.81 34.93,43.81 | v25.4,40.64 28.57,43.81 v29.21,43.81 34.93,43.81 | IC26.3 34.93,43.81 | v269.24,18.41 v250.83,18.41 249.56,19.68 184.15,19.68 177.8,13.34 133.35,13.34 133.35,7.62 132.08,6.35 v99.06,6.35 | IC20.12 300.35,53.98 v271.78,53.98
  Bottom 0.762: IC24.13 73.66,24.13 v73.66,42.55 | IC18.3 25.4,31.75 v25.4,40.64 | v29.21,43.81 IC22.4 | IC8.12 247.65,99.06 246.38,100.33 246.38,107.95 IC4.12 250.83,112.39 270.51,112.39 IC5.17 269.24,107.95 269.24,82.55 IC9.17 269.24,80.01 269.24,56.52 v271.78,53.98 270.51,52.7 IC21.17 270.51,43.18 269.24,41.91 v269.24,18.41 270.51,17.14 IC6.17 | v250.83,18.41 IC3.12 | v99.06,6.35 IC10.3
BUS3  (via drill 0.35)
  Top 0.762: IC24.12 71.75,24.77 v100.33,24.77 | v39.37,42.55 v71.12,42.55 | v271.78,84.45 v245.11,84.45 | v245.11,106.05 269.88,106.05 IC5.16 | v247.02,17.14 v271.78,17.14 274.32,19.68 290.83,19.68 v297.18,26.04
  Bottom 0.762: IC10.4 101.6,26.04 v100.33,24.77 107.95,17.14 107.95,3.81 109.85,1.91 245.11,1.91 245.11,15.24 | IC18.4 24.13,33.02 24.13,66.04 25.4,67.31 25.4,69.85 26.04,70.48 31.75,70.48 IC22.5 31.75,63.5 33.02,62.23 33.02,52.07 IC26.4 v39.37,42.55 | IC24.12 69.85,27.94 71.12,29.21 v71.12,42.55 | v245.11,84.45 IC8.13 | v245.11,106.05 IC4.13 | IC5.16 271.78,107.95 v271.78,84.45 273.05,83.19 IC9.16 271.78,80.01 271.78,55.88 273.05,54.61 IC21.16 271.78,46.99 v271.78,17.14 273.05,15.88 IC6.16 | v247.02,17.14 245.11,15.24 | 245.11,15.24 IC3.13 | IC20.13 297.18,41.91 v297.18,26.04
BUS4  (via drill 0.35)
  Top 0.762: IC24.11 70.48,26.04 v102.87,26.04 | IC18.5 22.22,33.66 v34.29,33.66 | v40.64,58.42 39.37,59.69 | 39.37,59.69 v34.29,64.77 | v66.04,52.7 59.05,59.69 39.37,59.69 | v272.41,10.79 v241.3,10.79 | IC20.14 297.81,51.44 v276.86,51.44 | v274.32,88.27 v245.11,88.27 | v109.22,4.45 110.49,3.17 v238.12,3.17
  Bottom 0.762: IC10.5 104.14,27.3 v102.87,26.04 109.22,19.68 v109.22,4.45 | 40.64,40.01 41.91,41.27 IC26.5 | 40.64,40.01 v34.29,33.66 | v34.29,64.77 IC22.6 | 40.64,40.01 v40.64,58.42 | IC24.11 67.31,27.94 66.04,29.21 v66.04,52.7 | 242.57,88.27 242.57,99.06 243.84,100.33 243.84,107.95 IC4.14 | 242.57,88.27 IC8.14 | IC3.14 v241.3,10.79 240.03,9.53 240.03,5.08 v238.12,3.17 | IC6.15 274.32,12.7 | 274.32,12.7 v272.41,10.79 | 274.32,46.99 IC21.15 275.59,50.16 v276.86,51.44 | 274.32,12.7 274.32,46.99 | 274.32,80.01 IC9.15 | 274.32,46.99 274.32,80.01 | IC5.15 274.32,107.95 v274.32,88.27 274.32,80.01 | v245.11,88.27 242.57,88.27
BUS5  (via drill 0.35)
  Top 0.762: IC18.6 14.61,28.57 13.33,28.57 12.7,29.21 12.7,38.1 v44.45,38.1 47.62,38.1 v48.26,37.47 | IC10.6 100.96,51.44 95.25,51.44 | 85.72,51.44 95.25,51.44 | 85.72,51.44 66.67,70.48 55.25,70.48 IC23.3 | v44.45,48.9 46.99,51.44 85.72,51.44 | v251.46,53.98 252.73,55.24 v275.59,55.24 v306.07,55.24 | 95.25,51.44 95.25,67.94 v251.46,67.94
  Bottom 0.762: v44.45,38.1 IC26.6 v44.45,48.9 | IC25.14 48.26,24.13 v48.26,37.47 | IC2.11 307.34,107.95 IC7.11 306.07,80.01 306.07,72.39 307.34,71.12 307.34,55.24 | IC1.11 307.34,15.24 307.34,55.24 | IC19.11 251.46,50.8 v251.46,53.98 v251.46,67.94 | 276.86,53.98 278.13,52.7 IC21.14 276.86,46.99 276.86,15.24 IC6.14 | 276.86,53.98 v275.59,55.24 | 276.86,80.01 IC9.14 | 276.86,53.98 276.86,80.01 | IC5.14 278.13,104.14 276.86,102.87 276.86,80.01 | v306.07,55.24 307.34,55.24
BUS6  (via drill 0.35)
  Top 0.762: IC18.7 18.41,34.92 v45.72,34.92 46.99,36.2 48.9,36.2 50.17,37.47 v53.34,37.47 102.87,37.47 v105.41,40.01 | v246.38,57.78 247.65,59.05 v278.13,59.05 | IC1.12 301.62,18.41 v279.4,18.41 | IC2.12 300.35,106.05 283.84,106.05 IC5.13 | v110.49,5.08 111.12,4.45 243.84,4.45 245.11,3.17 v277.5,3.17
  Bottom 0.762: IC25.13 45.72,24.13 v45.72,34.92 45.72,35.56 46.99,36.83 IC26.7 | IC10.7 105.41,41.91 v105.41,40.01 110.49,34.92 v110.49,5.08 | IC23.4 55.88,57.15 53.34,54.61 v53.34,37.47 | IC2.12 304.8,107.95 IC7.12 | v246.38,57.78 IC19.12 | 279.4,57.78 280.67,56.52 IC21.13 279.4,46.99 v279.4,18.41 279.4,15.24 | 279.4,57.78 v278.13,59.05 | 279.4,15.24 IC6.13 | 279.4,80.01 IC9.13 | 279.4,57.78 279.4,80.01 | IC5.13 279.4,107.95 279.4,80.01 | v277.5,3.17 279.4,5.08 279.4,15.24
BUS7  (via drill 0.35)
  Top 0.762: IC18.8 11.43,39.37 v50.17,39.37 52.07,41.27 v107.31,41.27 | IC23.5 56.52,66.67 v50.8,66.67 | IC19.13 248.28,43.81 v280.67,43.81 | v283.21,17.14 300.35,17.14 IC1.13 | v115.57,24.77 116.84,23.5 v234.95,23.5
  Bottom 0.762: v50.17,39.37 49.53,40.01 IC26.8 49.53,50.16 48.26,50.16 | IC25.12 43.18,24.13 43.18,49.53 43.82,50.16 48.26,50.16 | IC10.8 v107.31,41.27 115.57,33.02 v115.57,24.77 | v50.8,66.67 48.26,64.14 48.26,50.16 | 281.94,45.09 283.21,46.35 IC21.12 | 281.94,45.09 v280.67,43.81 | 281.94,45.09 281.94,80.01 IC9.12 284.48,82.55 284.48,110.49 | v283.21,17.14 IC6.12 | 284.48,110.49 285.12,111.12 300.99,111.12 IC2.13 302.26,107.95 IC7.13 303.53,80.01 303.53,72.39 304.8,71.12 304.8,15.24 IC1.13 | 284.48,110.49 IC5.12 | v234.95,23.5 242.57,31.11 242.57,46.99 IC19.13
BUS8  (via drill 0.35)
  Top 0.762: IC18.9 12.06,27.3 v41.91,27.3 v53.34,27.3 | IC10.9 112.39,43.81 100.96,43.81 100.33,44.45 100.33,48.9 v60.96,48.9 v52.07,48.9 | IC5.11 287.65,107.31 296.54,107.31 IC2.14 | v283.21,52.7 v243.84,52.7 | v116.84,25.4 117.47,24.77 v284.48,24.77
  Bottom 0.762: v41.91,27.3 IC25.11 | v53.34,27.3 53.34,31.75 52.07,33.02 IC26.9 v52.07,48.9 | v60.96,48.9 IC23.6 | IC7.14 299.72,107.95 IC2.14 | IC1.14 300.99,12.06 295.27,12.06 294.64,12.7 294.64,13.97 IC6.11 284.48,15.24 v284.48,24.77 284.48,51.44 | IC19.14 243.84,50.8 v243.84,52.7 | 284.48,51.44 285.75,50.16 IC21.11 | 284.48,51.44 v283.21,52.7 | 284.48,51.44 284.48,80.01 IC9.11 287.02,82.55 287.02,107.95 IC5.11 | IC10.9 116.84,43.18 v116.84,25.4
CLEARA  (via drill 0.35)
  Top 0.762: v127.63,112.39 v236.86,112.39 292.73,112.39 IC2.15
  Bottom 0.762: v127.63,112.39 U3.17 | IC4.15 v236.86,112.39
CLEARB
  Top 0.762: 241.94,83.19 IC8.15 | 241.94,83.19 295.27,83.19 IC7.15 | U3.13 130.18,88.27 228.6,88.27 233.68,83.19 241.94,83.19
CLEARF  (via drill 0.35)
  Top 0.762: v157.48,124.46 v63.5,124.46
  Bottom 0.762: v63.5,124.46 U2.15 | v157.48,124.46 162.56,119.38 IC15.15
CLEARI
  Top 0.762: IC19.15 240.67,50.16 296.54,50.16 IC20.15
  Bottom 0.762: U1.19 78.74,109.22 78.74,128.91 79.38,129.54 234.95,129.54 234.95,52.07 IC19.15
CLEARID  (via drill 0.35)
  Top 0.762: IC1.15 296.54,15.88 240.67,15.88 IC3.15 234.31,18.41 v184.78,18.41 | v158.75,119.38 v96.52,119.38
  Bottom 0.762: v96.52,119.38 U1.16 | v158.75,119.38 158.75,55.88 161.29,53.34 161.29,41.91 v184.78,18.41
CLOCK  (via drill 0.35)
  Top 0.762: IC25.7 42.55,33.66 47.62,33.66 48.9,34.92 60.33,34.92 62.87,32.38 | IC24.7 62.87,32.38 | v95.25,36.2 91.44,32.38 62.87,32.38 | IC31.1 IC31.2 208.92,94.61 247.02,94.61 249.56,97.16 | v250.83,34.29 v185.42,34.29 | 249.56,97.16 252.73,100.33 IC4.7 | IC2.7 308.61,97.16 249.56,97.16 | v97.79,34.29 100.96,31.11 v173.99,31.11
  Bottom 0.762: IC30.2 95.25,72.39 v95.25,36.2 97.79,36.2 v97.79,34.29 | JP2.1 17.14,6.99 17.14,6.35 18.41,5.08 22.86,5.08 22.86,24.13 23.5,24.77 27.94,24.77 27.94,21.59 28.57,20.95 38.1,20.95 38.1,29.21 IC25.7 | IC2.7 308.61,74.93 IC7.7 309.88,39.37 | IC1.7 309.88,7.62 309.88,39.37 | IC20.7 309.88,39.37 | IC3.7 252.73,7.62 252.73,34.29 | 252.73,39.37 252.73,34.29 | IC19.7 252.73,39.37 | v185.42,34.29 180.98,38.73 | 180.98,38.73 IC15.7 | 252.73,34.29 v250.83,34.29 | 252.73,39.37 IC8.7 252.73,75.56 254,76.83 254,100.33 IC4.7 | v173.99,31.11 180.98,38.1 180.98,38.73
COUNTEN
  Bottom 0.762: IC22.7 IC22.10 35.56,77.47 35.56,93.98 36.83,95.25 U2.19
D1
  Bottom 0.762: IC18.18 36.83,10.16 43.18,10.16 DATA.8
D2
  Top 0.762: IC18.17 21.59,17.14 31.75,17.14 40.64,8.26 DATA.7
D3
  Top 0.762: IC18.16 19.05,15.88 30.48,15.88 38.1,8.26 DATA.6
D4
  Bottom 0.762: IC18.15 14.61,20.95 14.61,6.35 17.14,3.81 35.56,3.81 DATA.5
D5
  Top 0.762: IC18.14 13.97,14.61 26.67,14.61 33.02,8.26 DATA.4
D6
  Top 0.762: IC18.13 11.43,13.34 25.4,13.34 30.48,8.26 DATA.3
D7
  Top 0.762: IC18.12 8.89,12.06 24.13,12.06 27.94,8.26 DATA.2
D8
  Top 0.762: IC18.11 6.35,10.79 22.22,10.79 DATA.1
GND  (via drill 0.35)
  Top 0.762: U3.20 U3.21 U3.22 U3.23 v104.77,104.78 | U3.2 U3.1 | v40.64,65.41 62.87,65.41 IC23.8 | IC24.1 IC24.2 74.3,27.3 64.14,27.3 60.96,30.48 | IC10.1 93.34,45.09 v91.44,45.09 | U1.23 U1.22 U1.21 U1.20 | U2.23 U2.22 U2.21 U2.20 36.2,109.86 57.79,109.86 U1.26 | U2.2 U2.1 13.97,45.72 | 60.96,30.48 IC25.1 IC25.2 50.17,32.38 45.72,32.38 45.72,29.21 45.09,28.57 38.74,28.57 IC25.8 | 60.96,30.48 IC24.8 | IC18.10 6.35,45.72 13.97,45.72 | IC26.1 13.97,45.72 | IC8.2 IC8.1 | IC4.1 IC4.2 243.21,104.78 v252.73,104.78 | IC29.7 158.12,99.69 175.26,99.69 176.53,98.42 | IC28.7 176.53,98.42 | 176.53,98.42 177.8,99.69 194.95,99.69 IC27.7 200.03,98.42 217.81,98.42 IC31.7 v237.49,96.52 | IC5.10 IC2.1 IC2.2 | IC9.10 IC7.1 IC7.2 | IC21.10 IC20.1 IC20.2 | IC6.10 IC1.1 IC1.2 | IC14.7 142.88,12.06 156.84,12.06 IC11.7 | IC15.2 IC15.1 151.77,52.7 150.5,52.7 IC12.8 | 225.43,41.27 IC16.7 | 225.43,41.27 235.59,41.27 IC19.1 IC19.2 240.67,42.55 252.09,42.55 IC19.8 | IC3.1 IC3.2 241.94,9.53 v255.27,9.53 310.51,9.53 IC1.8 | IC15.8 180.98,41.27 v201.93,41.27 225.43,41.27
  Bottom 0.762: IC30.8 111.76,76.2 111.76,96.52 116.2,100.97 116.2,107.31 U3.20 | v104.77,104.78 97.79,97.79 U3.2 99.06,91.44 99.06,71.12 110.49,59.69 110.49,52.07 IC10.10 118.11,44.45 118.11,8.89 121.28,5.71 139.7,5.71 IC14.7 | IC22.8 40.64,67.31 v40.64,65.41 | 90.17,43.81 80.01,33.66 IC24.1 | 90.17,43.81 v91.44,45.09 | 68.58,66.04 90.17,44.45 90.17,43.81 | 68.58,66.04 IC23.8 | 68.58,66.04 U3.1 | U1.2 59.69,95.25 59.69,100.33 | U1.26 59.69,100.33 | 59.69,100.33 U1.23 | U2.26 16.51,105.41 16.51,97.79 | U2.2 16.51,97.79 | 16.51,97.79 U2.23 | IC18.10 10.16,26.67 POWER.2 | IC26.1 33.02,44.45 33.02,33.02 35.56,30.48 IC25.8 | IC25.1 IC26.10 | IC4.8 252.73,104.14 v252.73,104.78 | IC8.1 237.49,78.74 238.76,80.01 238.76,96.52 | 238.76,96.52 238.76,100.33 IC4.1 | IC27.7 200.66,93.98 200.66,45.72 IC17.7 v201.93,41.27 | v237.49,96.52 238.76,96.52 | IC2.8 311.15,74.93 IC7.8 312.42,41.91 IC20.8 312.42,39.37 312.42,5.08 | IC2.1 293.37,74.93 IC7.1 | 312.42,5.08 311.78,4.45 302.26,4.45 | 312.42,5.08 IC1.8 | 302.26,4.45 298.45,4.45 IC1.2 | IC20.2 302.26,36.83 302.26,4.45 | IC7.2 297.18,43.81 295.91,42.55 IC20.1 | IC13.8 151.13,36.83 151.13,49.53 149.86,50.8 IC12.8 | IC15.8 175.9,46.35 162.56,46.35 IC15.2 | IC11.7 161.29,10.16 161.29,40.01 160.02,41.27 IC15.1 | IC3.8 255.27,7.62 v255.27,9.53 255.27,39.37 | IC19.8 255.27,39.37 | 255.27,39.37 IC8.8
HALT  (via drill 0.35)
  Top 0.762: v120.65,18.41 109.85,7.62 HALT.1
  Bottom 0.762: U3.19 117.47,107.31 117.47,99.69 116.84,99.06 116.84,73.66 120.65,69.85 v120.65,18.41
I1  (via drill 0.35)
  Top 0.762: v265.43,33.66 301.62,33.66 IC20.6
  Bottom 0.762: v265.43,33.66 IC21.2
I2  (via drill 0.35)
  Top 0.762: v269.24,45.09 301.62,45.09 IC20.5
  Bottom 0.762: IC21.3 267.97,43.81 v269.24,45.09
I3
  Top 0.762: IC21.4 273.69,37.47 300.35,37.47 IC20.4
I4
  Top 0.762: IC21.5 274.95,38.73 299.08,38.73 IC20.3
I5  (via drill 0.35)
  Top 0.762: v251.46,35.56 252.09,34.92 v275.59,34.92 | v34.93,98.42 v69.85,98.42 71.12,99.69 v107.95,99.69 | v246.38,95.89 244.48,97.79 220.98,97.79 217.17,101.6 v114.94,101.6
  Bottom 0.762: v251.46,35.56 251.46,38.1 IC19.6 247.65,41.91 247.65,71.12 246.38,72.39 v246.38,95.89 | IC21.6 v275.59,34.92 | v34.93,98.42 U2.7 | U1.7 v69.85,98.42 | U3.7 107.95,95.25 v107.95,99.69 107.95,101.6 v114.94,101.6
I6  (via drill 0.35)
  Top 0.762: IC19.5 248.28,38.73 258.44,38.73 262.25,42.55 276.22,42.55 IC21.7 | v33.02,89.53 34.29,88.27 v72.39,88.27 108.58,88.27 U3.8 | v193.04,35.56 v246.38,35.56 | v179.07,78.74 175.26,82.55 v115.57,82.55
  Bottom 0.762: U2.8 33.02,91.44 v33.02,89.53 | v72.39,88.27 U1.8 | v246.38,35.56 IC19.5 | v193.04,35.56 179.07,49.53 v179.07,78.74 | v115.57,82.55 113.03,85.09 U3.8
I7  (via drill 0.35)
  Top 0.762: v280.67,31.75 v243.84,31.75 v194.95,31.75 | v34.29,87 v74.93,87 109.85,87 U3.9 124.46,83.82 v176.53,83.82
  Bottom 0.762: v243.84,31.75 IC19.4 | IC21.8 v280.67,31.75 | v34.29,87 U2.9 | v74.93,87 U1.9 | v194.95,31.75 176.53,50.16 v176.53,83.82
I8  (via drill 0.35)
  Top 0.762: v281.94,36.2 273.05,36.2 272.41,36.83 245.11,36.83 IC19.3 239.4,38.73 v227.33,38.73 | v39.37,95.89 40.64,97.16 v73.02,97.16 74.3,98.42 v118.11,98.42 | v201.93,87 123.83,87 U3.10
  Bottom 0.762: v281.94,36.2 283.21,37.47 IC21.9 | U2.10 39.37,95.25 v39.37,95.89 | U1.10 v73.02,97.16 | v118.11,98.42 U3.10 | v227.33,38.73 227.33,60.96 201.93,86.36 v201.93,87
N$1
  Bottom 0.762: IC13.9 148.59,44.45 148.59,52.07 IC12.7
N$2
  Bottom 0.762: IC14.8 140.34,17.14 140.34,28.57 143.51,31.75 143.51,57.78 144.78,59.05 IC12.11
N$3  (via drill 0.35)
  Top 0.762: IC12.9 151.13,59.69 v163.83,59.69
  Bottom 0.762: v163.83,59.69 165.1,58.42 IC15.14
N$4  (via drill 0.35)
  Top 0.762: IC10.14 111.12,55.24 137.8,55.24 IC12.4 | v139.7,73.66 v204.47,73.66
  Bottom 0.762: IC16.6 218.44,45.72 218.44,59.69 v204.47,73.66 | v139.7,73.66 138.43,72.39 138.43,57.78 139.7,56.52 IC12.4
N$5  (via drill 0.35)
  Top 0.762: IC10.13 113.66,51.44 130.18,51.44 IC12.1 | v132.08,29.21 v201.93,29.21
  Bottom 0.762: v201.93,29.21 IC16.5 | v132.08,29.21 130.81,30.48 130.81,39.37 133.35,41.91 133.35,52.07 IC12.1
N$6  (via drill 0.35)
  Top 0.762: IC14.11 134.62,19.05 v141.61,19.05
  Bottom 0.762: v141.61,19.05 144.78,22.23 IC13.6
N$7  (via drill 0.35)
  Top 0.762: IC14.3 129.54,13.34 v131.45,13.34
  Bottom 0.762: v131.45,13.34 133.35,15.24 133.35,34.29 IC13.2
N$8  (via drill 0.35)
  Top 0.762: v138.43,44.45 137.8,45.09 136.53,45.09 IC13.15
  Bottom 0.762: IC11.6 155.58,6.99 146.05,6.99 146.05,10.16 141.61,14.61 138.43,14.61 v138.43,44.45
N$9
  Bottom 0.762: IC11.3 148.59,10.16 148.59,39.37 IC13.11
N$10  (via drill 0.35)
  Top 0.762: 137.8,33.66 IC13.4 | v100.33,33.66 137.8,33.66 | v220.98,33.02 175.9,33.02 175.26,33.66 137.8,33.66
  Bottom 0.762: v100.33,33.66 100.33,52.07 IC10.18 | IC16.8 220.98,50.8 v220.98,33.02
N$11  (via drill 0.35)
  Top 0.762: IC13.1 128.91,35.56 128.27,36.2 | 128.27,36.2 118.11,46.35 118.11,47.62 107.31,47.62 IC10.17 | v223.52,30.48 220.98,27.94 102.23,27.94 96.52,33.66 96.52,36.2 128.27,36.2
  Bottom 0.762: IC16.9 221.62,53.98 223.52,53.98 v223.52,30.48
N$12  (via drill 0.35)
  Top 0.762: IC13.13 139.7,48.9 108.58,48.9 IC10.16 | v200.66,30.48 176.53,30.48 174.62,32.38 v142.24,32.38
  Bottom 0.762: IC16.11 213.36,50.8 213.36,43.18 v200.66,30.48 | v142.24,32.38 140.97,33.66 140.97,41.91 IC13.13
N$13  (via drill 0.35)
  Top 0.762: IC10.15 117.47,64.14 v146.05,64.14 149.23,64.14 151.13,62.23 212.09,62.23 IC16.12
  Bottom 0.762: IC13.10 147.32,50.8 146.05,52.07 v146.05,64.14
N$14  (via drill 0.35)
  Top 0.762: v210.82,53.34 207.01,57.15 143.51,57.15 141.61,59.05 | IC12.13 141.61,59.05 | v116.84,57.78 118.11,59.05 141.61,59.05
  Bottom 0.762: IC16.3 210.82,45.72 v210.82,53.34 | IC10.12 116.84,55.88 v116.84,57.78
N$15  (via drill 0.35)
  Top 0.762: v118.11,60.33 120.65,62.87 145.42,62.87 IC12.10 149.86,58.42 207.65,58.42 v208.28,57.78
  Bottom 0.762: IC10.11 118.11,54.61 v118.11,60.33 | IC16.2 209.55,49.53 208.28,50.8 v208.28,57.78
N$16
  Top 0.762: IC17.1 188.59,46.35 205.11,46.35 IC16.1
N$17  (via drill 0.35)
  Top 0.762: IC22.15 27.3,79.38 v60.96,79.38
  Bottom 0.762: v60.96,79.38 63.5,76.83 IC23.10 IC23.7
N$18  (via drill 0.35)
  Top 0.762: v45.09,95.89 86.36,95.89 87.63,97.16 125.73,97.16 126.36,97.79 v136.53,97.79
  Bottom 0.762: v45.09,95.89 U2.12 | v136.53,97.79 138.43,97.79 140.97,100.33 144.78,100.33 IC29.3
N$19
  Top 0.762: IC22.2 26.04,66.67 48.9,66.67 IC23.2
N$20  (via drill 0.35)
  Top 0.762: v40.64,114.94 43.82,118.11 v147.32,118.11
  Bottom 0.762: U2.11 40.64,93.98 v40.64,114.94 | v147.32,118.11 148.59,116.84 148.59,97.79 IC29.5
N$21  (via drill 0.35)
  Top 0.762: v157.48,42.55 154.31,45.72 v146.05,45.72
  Bottom 0.762: IC11.8 157.48,19.05 v157.48,42.55 | v146.05,45.72 144.78,46.99 IC12.6
N$22  (via drill 0.35)
  Top 0.762: v152.4,46.99 149.23,50.16 137.8,50.16 IC12.2
  Bottom 0.762: v152.4,46.99 IC11.11
N$23
  Bottom 0.762: IC14.6 135.89,10.16 135.89,56.52 134.62,57.78 IC12.15
N$24
  Bottom 0.762: IC26.18 36.83,66.04 35.56,67.31 35.56,70.48 31.75,74.3 30.48,74.3 30.48,77.47 29.84,78.11 26.67,78.11 IC22.14
N$25
  Bottom 0.762: IC26.17 37.47,51.44 35.56,51.44 35.56,61.59 33.02,64.14 33.02,71.12 31.11,73.03 29.21,73.03 IC22.13
N$26
  Top 0.762: IC17.2 191.14,42.55 212.73,42.55 IC16.4
N$27
  Bottom 0.762: IC17.4 198.76,40.01 205.74,40.01 205.74,57.15 207.65,59.05 217.17,59.05 IC16.10
N$28  (via drill 0.35)
  Top 0.762: v196.85,47.62 198.12,48.9 206.38,48.9 IC16.13
  Bottom 0.762: v196.85,47.62 IC17.5
N$29
  Bottom 0.762: IC17.3 195.58,48.26 195.58,53.34 196.22,53.98 199.39,53.98 IC17.9
N$30
  Bottom 0.762: IC17.6 198.12,45.72 198.12,50.8 IC17.10
N$31
  Top 0.762: IC15.13 169.55,50.16 200.03,50.16 IC17.8
N$32  (via drill 0.35)
  Top 0.762: v41.91,73.03 40.64,74.3 33.66,74.3 IC22.12
  Bottom 0.762: v41.91,73.03 IC26.16
N$33  (via drill 0.35)
  Top 0.762: v43.18,77.47 42.55,78.11 36.2,78.11 IC22.11
  Bottom 0.762: IC26.15 43.18,54.61 v43.18,77.47
N$34  (via drill 0.35)
  Top 0.762: v46.99,73.66 47.62,74.3 51.44,74.3 IC23.14
  Bottom 0.762: v46.99,73.66 IC26.14
N$35  (via drill 0.35)
  Top 0.762: v54.61,58.42 IC26.13
  Bottom 0.762: v54.61,58.42 54.61,73.03 55.88,74.3 IC23.13
N$36
  Bottom 0.762: IC26.12 52.07,72.39 54.61,74.93 54.61,77.47 55.25,78.11 58.42,78.11 IC23.12
N$37
  Bottom 0.762: IC26.11 57.15,50.8 57.15,40.64 57.79,40.01 62.23,40.01 62.23,74.93 IC23.11
N$38  (via drill 0.35)
  Top 0.762: v48.26,102.23 49.53,100.97 113.66,100.97 114.94,99.69 136.53,99.69 IC29.1
  Bottom 0.762: U2.16 48.26,104.14 v48.26,102.23
N$39  (via drill 0.35)
  Top 0.762: v163.83,116.84 44.45,116.84 40.64,113.03 v39.37,113.03
  Bottom 0.762: v163.83,116.84 IC28.13 | U2.18 v39.37,113.03
N$40  (via drill 0.35)
  Top 0.762: v92.71,113.67 94.61,115.57 v165.1,115.57
  Bottom 0.762: U1.11 92.71,105.41 v92.71,113.67 | v165.1,115.57 168.91,111.76 IC28.11
N$41  (via drill 0.35)
  Top 0.762: v168.28,121.92 v106.68,121.92
  Bottom 0.762: U1.12 93.98,104.14 93.98,109.22 v106.68,121.92 | v168.28,121.92 173.99,116.2 IC28.9
N$42  (via drill 0.35)
  Top 0.762: v88.27,95.89 125.73,95.89 127,94.61 135.89,94.61 137.16,93.34 168.28,93.34 IC28.5
  Bottom 0.762: v88.27,95.89 U1.13
N$43  (via drill 0.35)
  Top 0.762: v90.8,111.12 v165.1,111.12
  Bottom 0.762: IC28.3 165.1,97.79 v165.1,111.12 | U1.15 v90.8,111.12
N$44  (via drill 0.35)
  Top 0.762: v160.02,114.3 95.25,114.3 93.34,112.39 v85.09,112.39
  Bottom 0.762: IC28.1 160.02,97.79 v160.02,114.3 | v85.09,112.39 82.55,109.86 U1.17
N$45
  Bottom 0.762: IC27.9 171.45,128.27 80.01,128.27 U1.18
N$46  (via drill 0.35)
  Top 0.762: v127.63,104.78 128.91,106.05 188.59,106.05 IC27.11
  Bottom 0.762: U3.11 127.63,99.69 v127.63,104.78
N$47  (via drill 0.35)
  Top 0.762: v127,96.52 127.63,95.89 136.53,95.89 137.8,94.61 156.84,94.61 160.66,98.42 174.62,98.42 175.26,97.79 175.26,94.61 178.44,94.61 182.25,98.42 191.14,98.42 IC27.5
  Bottom 0.762: v127,96.52 U3.12
N$48  (via drill 0.35)
  Top 0.762: v186.69,107.31 186.06,107.95 U3.15
  Bottom 0.762: IC27.3 187.96,101.6 186.69,102.87 v186.69,107.31
N$49  (via drill 0.35)
  Top 0.762: v179.71,109.86 127.63,109.86 U3.16
  Bottom 0.762: v179.71,109.86 IC27.13
N$50
  Bottom 0.762: IC27.1 177.8,101.6 177.8,116.2 167.01,127 120.65,127 U3.18
N$51
  Top 0.762: U2.3 20.95,94.61 57.79,94.61 | U1.3 57.79,94.61 | U3.3 98.42,94.61 57.79,94.61
  Bottom 0.762: U3.3 IC30.14
N$55
  Top 0.762: U2.4 23.5,90.81 60.33,90.81 | U1.4 60.33,90.81 | U3.4 100.96,90.81 60.33,90.81
  Bottom 0.762: U3.4 IC30.13
N$56  (via drill 0.35)
  Top 0.762: v32.38,84.45 v64.77,84.45 103.5,84.45 IC30.12
  Bottom 0.762: v32.38,84.45 U2.5 | v64.77,84.45 U1.5 | IC30.12 U3.5
N$57  (via drill 0.35)
  Top 0.762: U3.6 104.77,89.53 v69.21,89.53
  Bottom 0.762: U3.6 IC30.11 | U2.6 35.56,101.6 35.56,111.76 49.53,125.73 68.58,125.73 68.58,93.98 U1.6 67.31,91.44 v69.21,89.53
RWIO  (via drill 0.35)
  Top 0.762: v38.1,53.98 38.1,48.9 v27.94,48.9
  Bottom 0.762: 27.94,29.21 24.77,26.04 20.32,26.04 20.32,8.89 JP2.2 | 27.94,29.21 IC18.1 | U2.13 38.1,86.36 v38.1,53.98 | 27.94,29.21 v27.94,48.9
VCC  (via drill 0.35)
  Top 0.762: v52.07,26.04 32.38,26.04 31.11,24.77 | IC18.20 31.11,24.77 | POWER.1 5.08,10.16 5.08,24.77 31.11,24.77 | IC22.16 26.04,71.75 43.18,71.75 45.09,73.66 | 45.09,73.66 47.62,76.2 IC23.16 | U1.1 53.98,92.08 v48.26,92.08 | IC30.10 IC30.9 114.3,81.28 v132.08,81.28 | U3.26 U3.27 | IC30.7 108.58,76.83 97.16,76.83 IC30.1 92.71,72.39 46.36,72.39 45.09,73.66 | IC11.14 142.88,14.61 126.36,14.61 IC14.14 124.46,22.23 80.64,22.23 IC24.16 | v20.32,64.77 IC26.20 | IC2.16 291.46,111.12 267.33,111.12 266.7,110.49 266.7,107.31 264.79,107.31 IC5.20 | IC3.16 233.05,17.14 v232.41,17.14 | IC19.16 236.22,51.44 | 236.22,51.44 v236.22,52.7 | IC15.16 161.93,53.98 184.78,53.98 | IC17.14 184.78,53.98 | IC16.14 205.11,53.98 184.78,53.98 | 236.22,51.44 v262.89,51.44
  Bottom 0.762: IC18.20 30.48,24.13 30.48,52.07 IC26.20 | IC25.16 52.07,25.4 v52.07,26.04 | U1.1 57.15,95.25 U1.27 | U2.27 15.24,106.68 15.24,82.55 20.32,77.47 | IC22.16 20.32,77.47 | IC23.16 v48.26,92.08 | IC30.10 IC30.7 | U3.27 96.52,106.68 96.52,83.82 IC30.16 IC30.1 93.98,73.66 IC10.20 92.71,52.07 92.71,35.56 IC24.16 | 20.32,77.47 v20.32,64.77 | IC2.16 294.64,107.95 IC7.16 295.91,80.01 IC20.16 294.64,46.99 294.64,39.37 295.91,38.1 IC1.16 | IC5.20 IC5.1 IC9.20 IC9.1 v262.89,51.44 IC21.20 IC21.1 262.89,34.29 266.7,30.48 266.7,12.7 266.06,12.06 262.89,12.06 | IC6.20 262.89,12.06 | 262.89,12.06 IC6.1 | IC13.16 130.81,44.45 130.81,59.69 IC12.16 v132.08,81.28 132.08,96.52 IC29.14 139.7,121.92 158.12,121.92 158.75,121.28 | IC28.14 161.29,118.75 158.75,121.28 | IC4.16 236.22,107.95 236.22,82.55 IC8.16 236.22,80.01 v236.22,52.7 | 232.41,27.94 232.41,38.1 234.95,40.64 234.95,46.99 IC19.16 | 232.41,27.94 v232.41,17.14 | IC27.14 186.69,100.33 186.69,90.17 | IC17.14 186.69,90.17 | IC31.14 200.03,104.14 200.03,104.78 198.76,106.05 196.85,106.05 196.85,102.87 191.77,97.79 191.77,95.25 186.69,90.17 | 232.41,27.94 199.39,27.94 199.39,31.75 208.28,40.64 208.28,48.9 207.01,50.16 IC16.14 | 158.75,121.28 157.48,120.02 157.48,54.61 IC15.16

### Text on the board
tNames: SPU | designed by Thomas Li